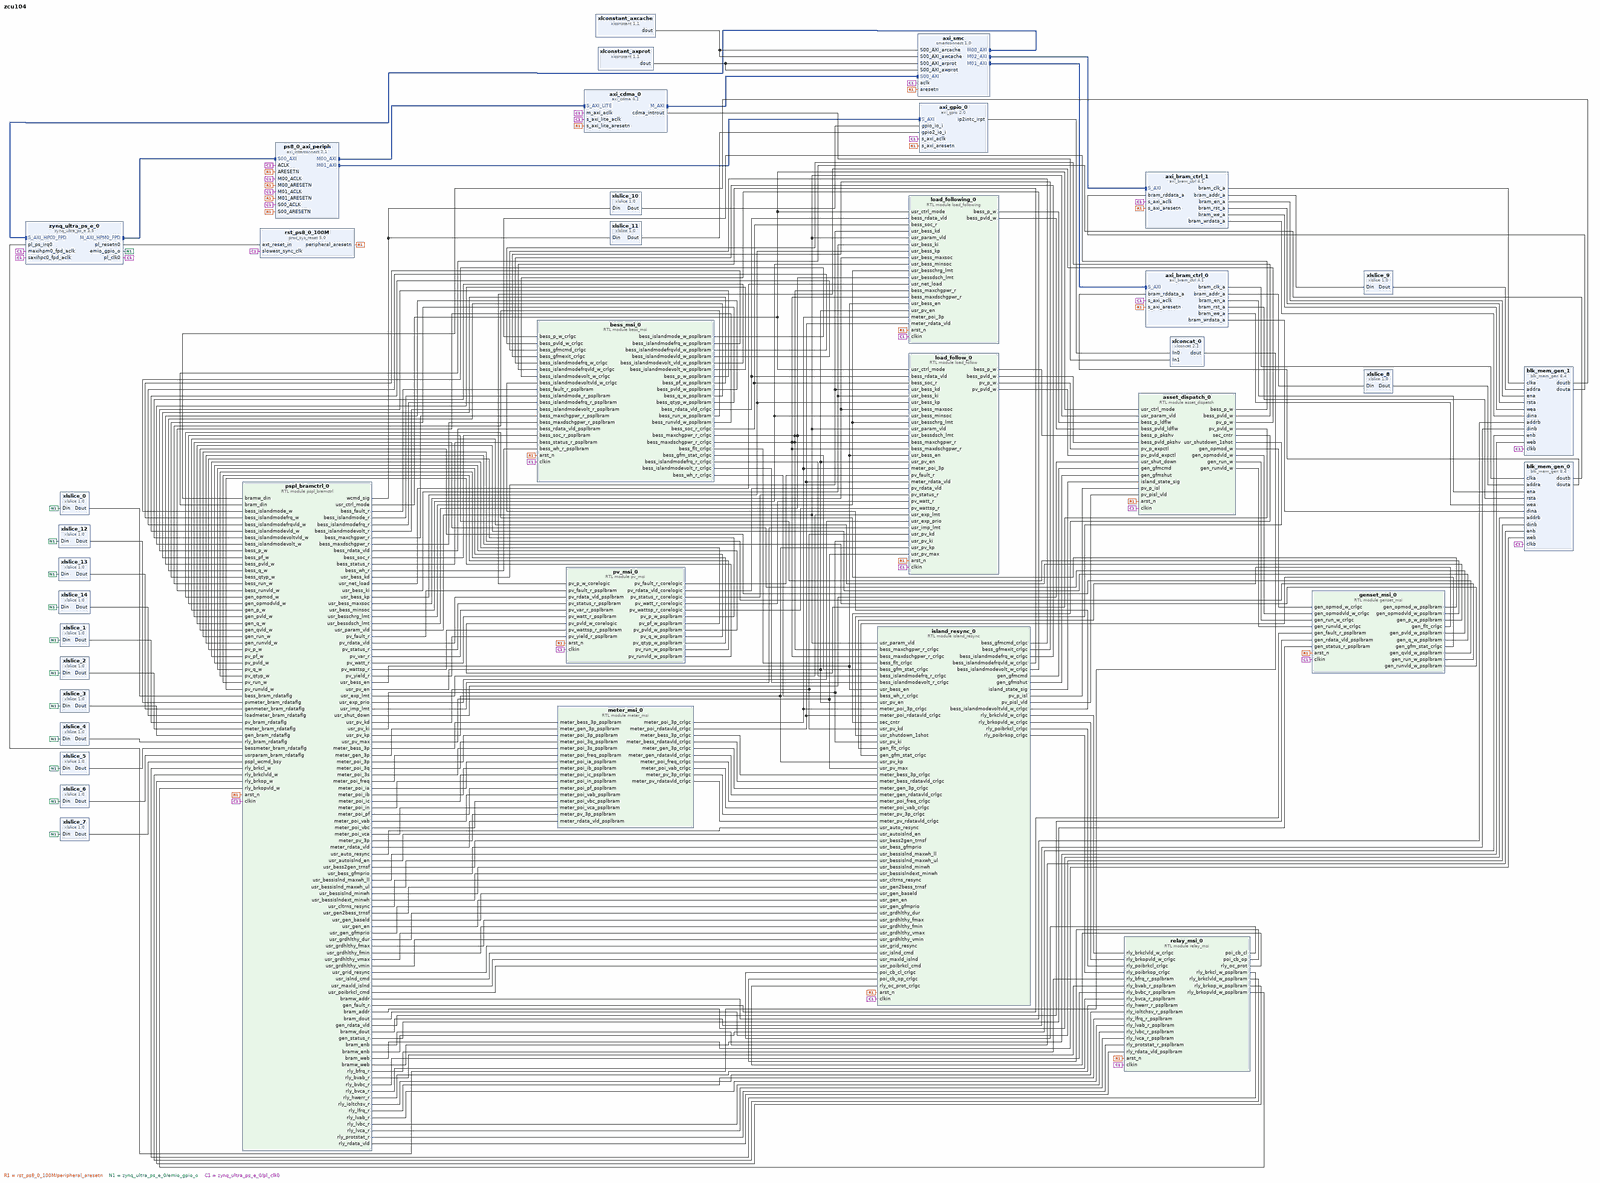
[diagram p0: block diagram of the top level, whole]
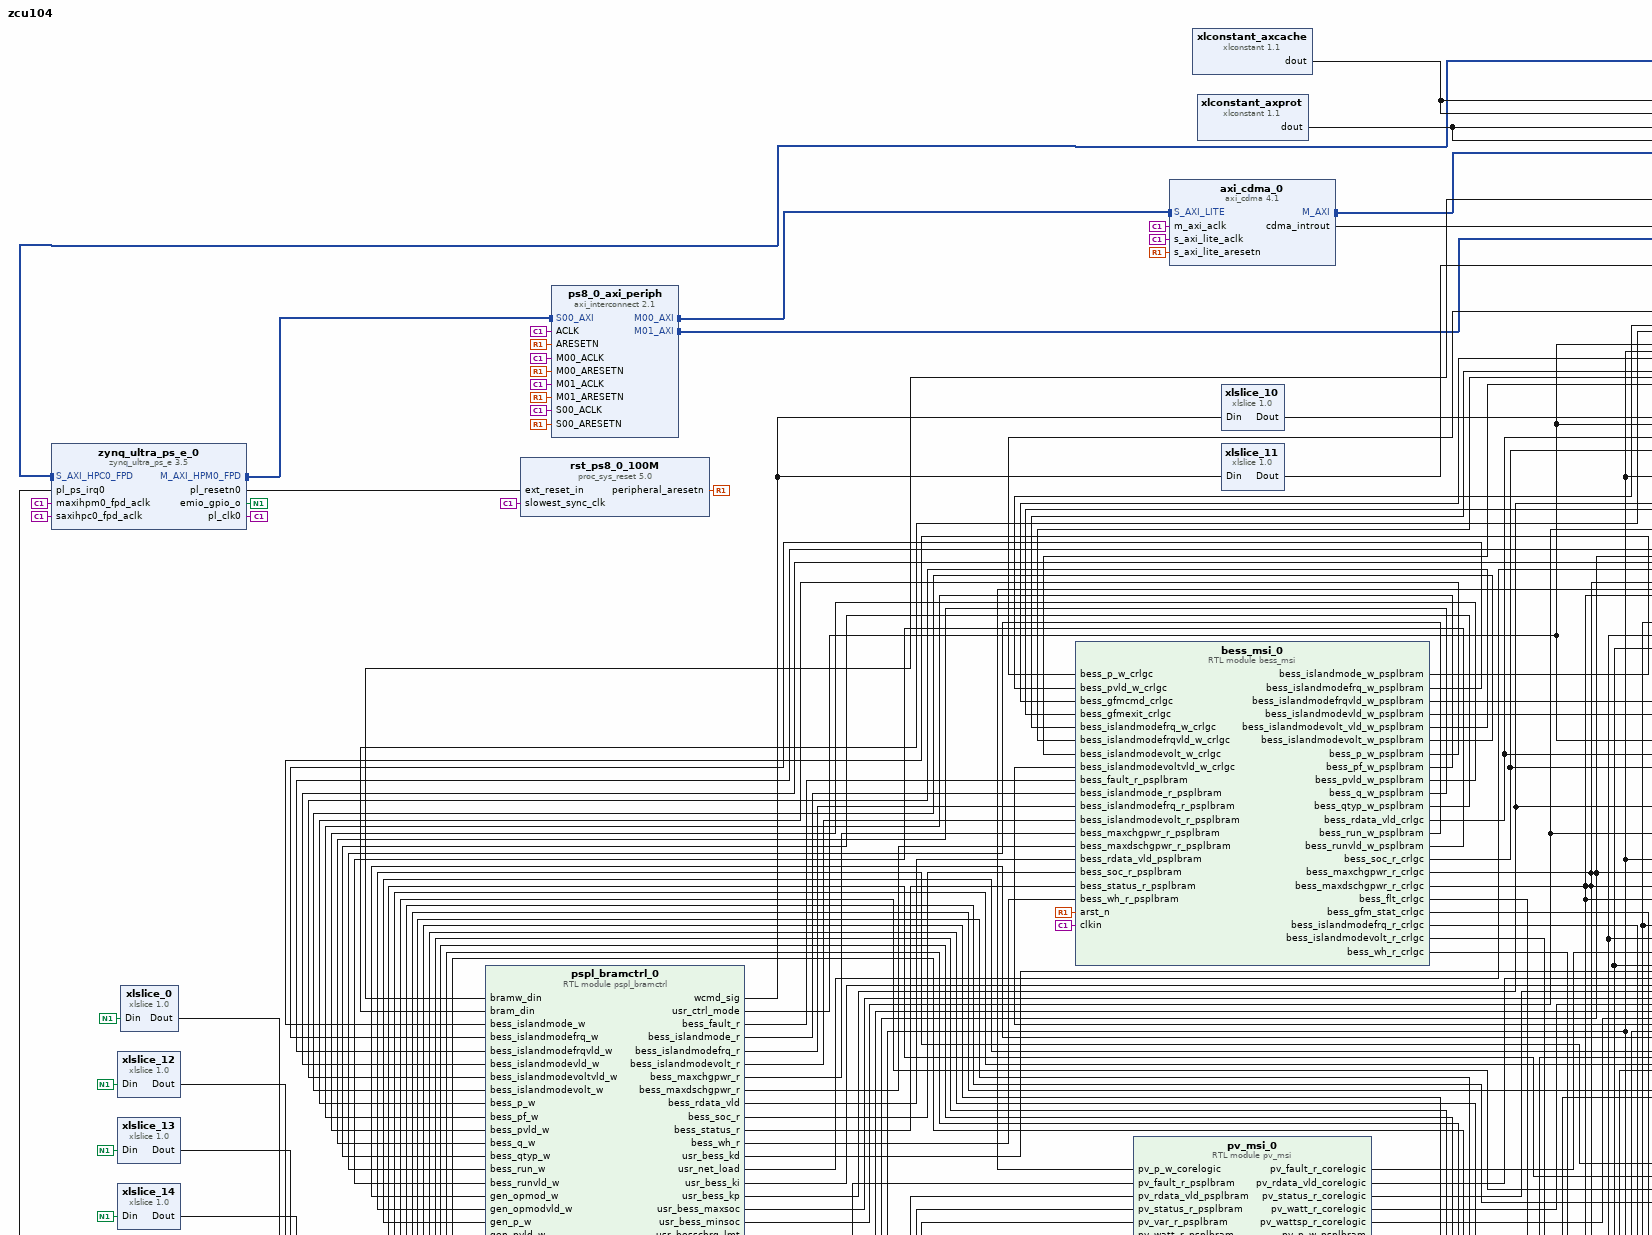
[diagram p1: block diagram of the top level, upper left part]
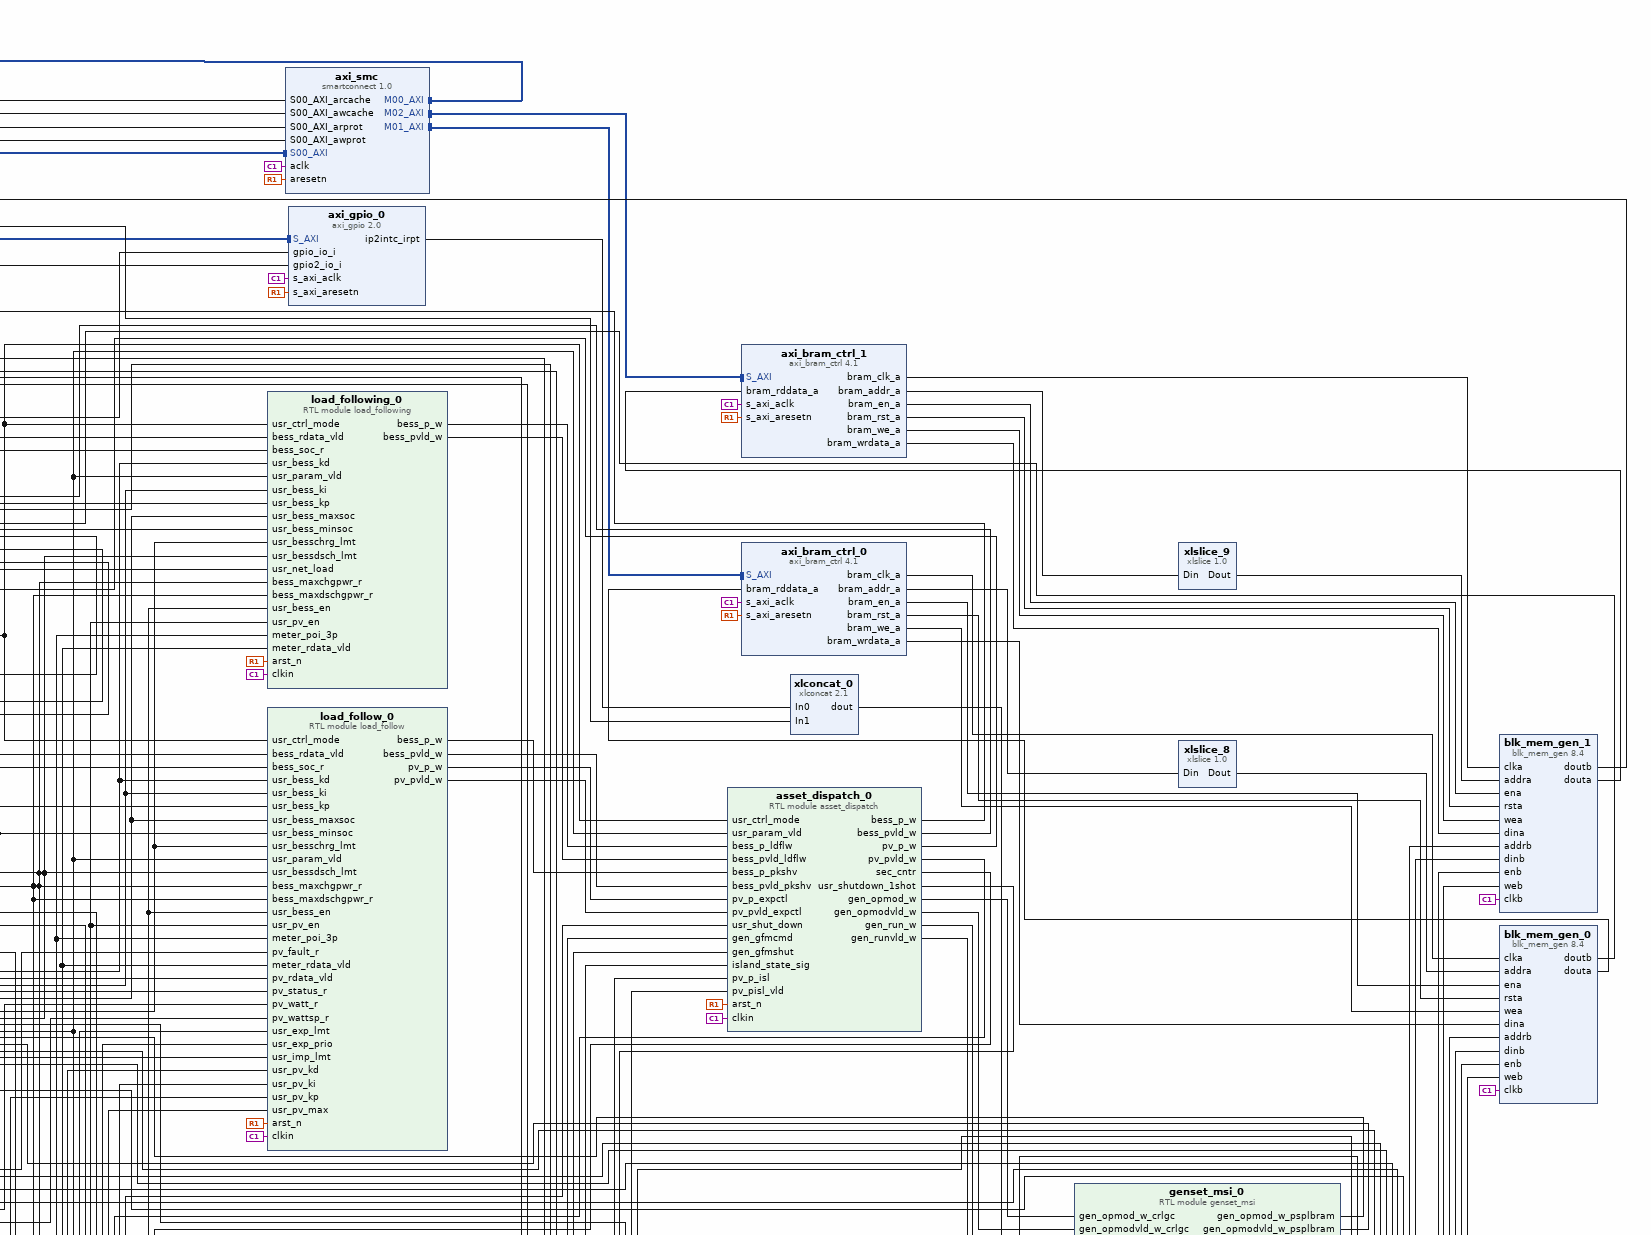
[diagram p2: block diagram of the top level, upper right part]
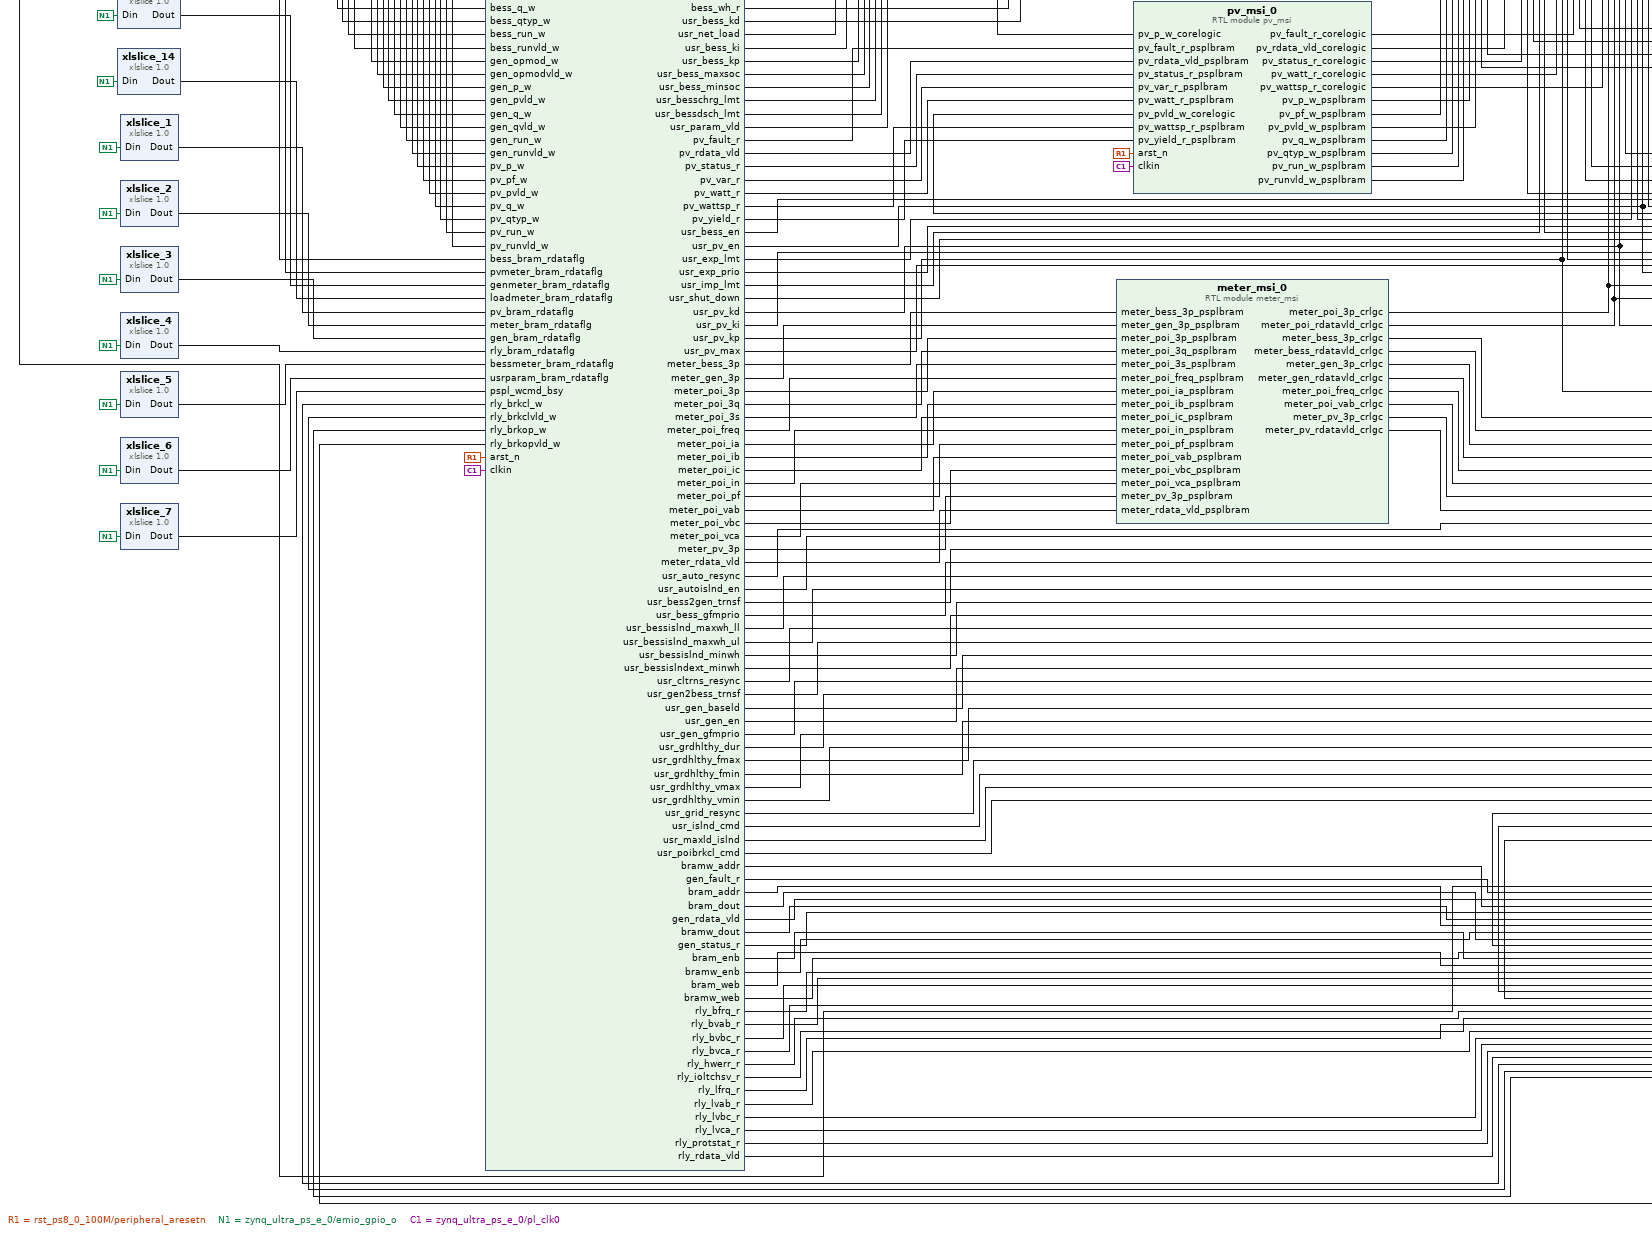
[diagram p3: block diagram of the top level, lower left part]
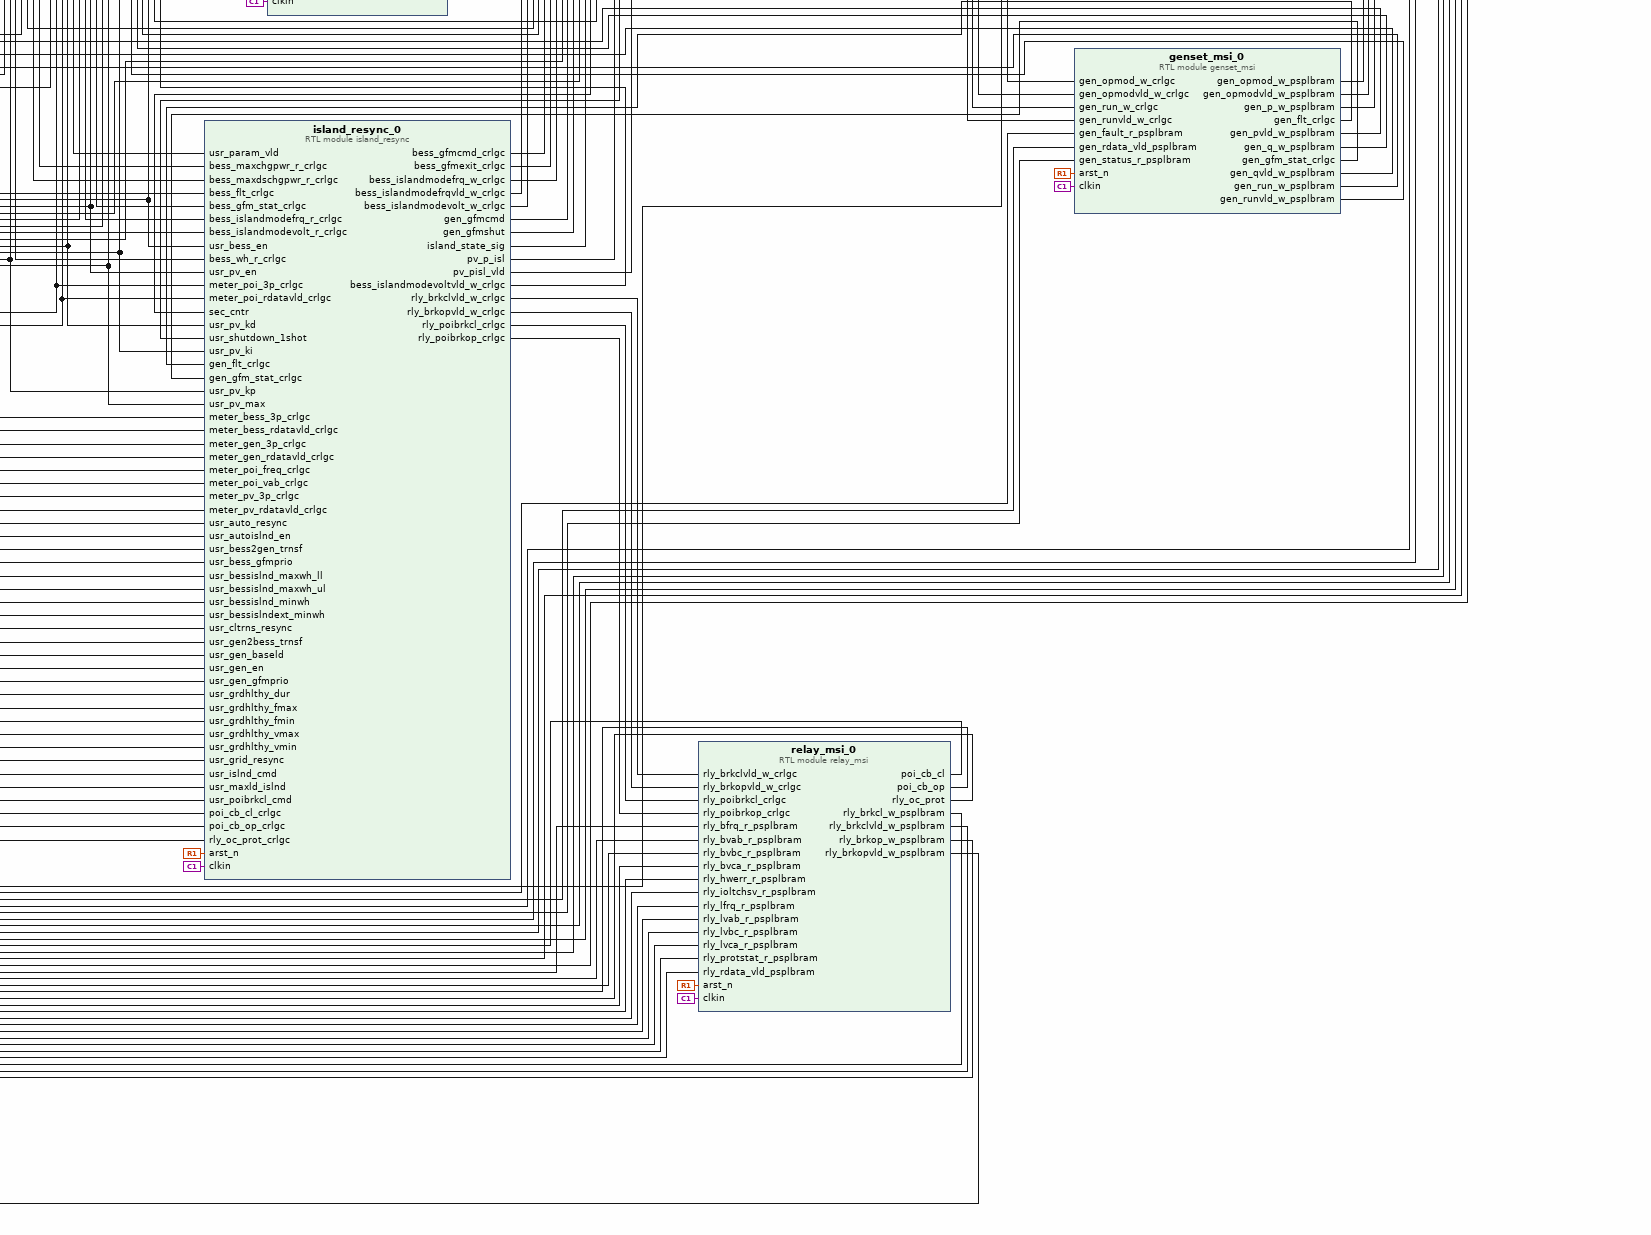
[diagram p4: block diagram of the top level, lower right part]
# Vivado block design zcu104, xczu7ev-ffvc1156-2-e, Vivado 2023.1
create_bd_design zcu104

create_bd_cell -type ip -vlnv xilinx.com:ip:xlslice:1.0 xlslice_0
set_property -dict {CONFIG.DIN_FROM 0 CONFIG.DIN_TO 0 CONFIG.DIN_WIDTH 16 CONFIG.DOUT_WIDTH 1} [get_bd_cells xlslice_0]
create_bd_cell -type ip -vlnv xilinx.com:ip:xlslice:1.0 xlslice_1
set_property -dict {CONFIG.DIN_FROM 1 CONFIG.DIN_TO 1 CONFIG.DIN_WIDTH 16 CONFIG.DOUT_WIDTH 1} [get_bd_cells xlslice_1]
create_bd_cell -type ip -vlnv xilinx.com:ip:xlslice:1.0 xlslice_2
set_property -dict {CONFIG.DIN_FROM 2 CONFIG.DIN_TO 2 CONFIG.DIN_WIDTH 16 CONFIG.DOUT_WIDTH 1} [get_bd_cells xlslice_2]
create_bd_cell -type ip -vlnv xilinx.com:ip:xlslice:1.0 xlslice_3
set_property -dict {CONFIG.DIN_FROM 3 CONFIG.DIN_TO 3 CONFIG.DIN_WIDTH 16 CONFIG.DOUT_WIDTH 1} [get_bd_cells xlslice_3]
create_bd_cell -type ip -vlnv xilinx.com:ip:xlslice:1.0 xlslice_4
set_property -dict {CONFIG.DIN_FROM 4 CONFIG.DIN_TO 4 CONFIG.DIN_WIDTH 16 CONFIG.DOUT_WIDTH 1} [get_bd_cells xlslice_4]
create_bd_cell -type ip -vlnv xilinx.com:ip:xlslice:1.0 xlslice_5
set_property -dict {CONFIG.DIN_FROM 5 CONFIG.DIN_TO 5 CONFIG.DIN_WIDTH 16 CONFIG.DOUT_WIDTH 1} [get_bd_cells xlslice_5]
create_bd_cell -type ip -vlnv xilinx.com:ip:xlslice:1.0 xlslice_6
set_property -dict {CONFIG.DIN_FROM 6 CONFIG.DIN_TO 6 CONFIG.DIN_WIDTH 16 CONFIG.DOUT_WIDTH 1} [get_bd_cells xlslice_6]
create_bd_cell -type ip -vlnv xilinx.com:ip:xlslice:1.0 xlslice_7
set_property -dict {CONFIG.DIN_FROM 7 CONFIG.DIN_TO 7 CONFIG.DIN_WIDTH 16 CONFIG.DOUT_WIDTH 1} [get_bd_cells xlslice_7]
create_bd_cell -type ip -vlnv xilinx.com:ip:xlslice:1.0 xlslice_8
set_property -dict {CONFIG.DIN_FROM 11 CONFIG.DIN_TO 2 CONFIG.DIN_WIDTH 12 CONFIG.DOUT_WIDTH 10} [get_bd_cells xlslice_8]
create_bd_cell -type ip -vlnv xilinx.com:ip:xlslice:1.0 xlslice_9
set_property -dict {CONFIG.DIN_FROM 11 CONFIG.DIN_TO 2 CONFIG.DIN_WIDTH 12 CONFIG.DOUT_WIDTH 10} [get_bd_cells xlslice_9]
create_bd_cell -type ip -vlnv xilinx.com:ip:xlslice:1.0 xlslice_10
set_property -dict {CONFIG.DIN_FROM 31 CONFIG.DIN_TO 0 CONFIG.DIN_WIDTH 64 CONFIG.DOUT_WIDTH 32} [get_bd_cells xlslice_10]
create_bd_cell -type ip -vlnv xilinx.com:ip:xlslice:1.0 xlslice_11
set_property -dict {CONFIG.DIN_FROM 63 CONFIG.DIN_TO 32 CONFIG.DIN_WIDTH 64 CONFIG.DOUT_WIDTH 32} [get_bd_cells xlslice_11]
create_bd_cell -type ip -vlnv xilinx.com:ip:xlslice:1.0 xlslice_12
set_property -dict {CONFIG.DIN_FROM 8 CONFIG.DIN_TO 8 CONFIG.DIN_WIDTH 16 CONFIG.DOUT_WIDTH 1} [get_bd_cells xlslice_12]
create_bd_cell -type ip -vlnv xilinx.com:ip:xlslice:1.0 xlslice_13
set_property -dict {CONFIG.DIN_FROM 9 CONFIG.DIN_TO 9 CONFIG.DIN_WIDTH 16 CONFIG.DOUT_WIDTH 1} [get_bd_cells xlslice_13]
create_bd_cell -type ip -vlnv xilinx.com:ip:xlslice:1.0 xlslice_14
set_property -dict {CONFIG.DIN_FROM 10 CONFIG.DIN_TO 10 CONFIG.DIN_WIDTH 16 CONFIG.DOUT_WIDTH 1} [get_bd_cells xlslice_14]
create_bd_cell -type module -reference asset_dispatch asset_dispatch_0
create_bd_cell -type module -reference bess_msi bess_msi_0
create_bd_cell -type module -reference meter_msi meter_msi_0
create_bd_cell -type module -reference relay_msi relay_msi_0
create_bd_cell -type module -reference genset_msi genset_msi_0
create_bd_cell -type ip -vlnv xilinx.com:ip:xlconcat:2.1 xlconcat_0
create_bd_cell -type ip -vlnv xilinx.com:ip:axi_bram_ctrl:4.1 axi_bram_ctrl_0
set_property -dict {CONFIG.SINGLE_PORT_BRAM 1} [get_bd_cells axi_bram_ctrl_0]
create_bd_cell -type ip -vlnv xilinx.com:ip:axi_bram_ctrl:4.1 axi_bram_ctrl_1
set_property -dict {CONFIG.SINGLE_PORT_BRAM 1} [get_bd_cells axi_bram_ctrl_1]
create_bd_cell -type ip -vlnv xilinx.com:ip:axi_cdma:4.1 axi_cdma_0
set_property -dict {CONFIG.C_ADDR_WIDTH 64 CONFIG.C_INCLUDE_DRE 1 CONFIG.C_INCLUDE_SG 0} [get_bd_cells axi_cdma_0]
create_bd_cell -type ip -vlnv xilinx.com:ip:blk_mem_gen:8.4 blk_mem_gen_1
set_property -dict [list \
  CONFIG.Byte_Size 8 \
  CONFIG.EN_SAFETY_CKT true \
  CONFIG.Enable_32bit_Address false \
  CONFIG.Enable_B Use_ENB_Pin \
  CONFIG.Memory_Type True_Dual_Port_RAM \
  CONFIG.Port_B_Clock 100 \
  CONFIG.Port_B_Enable_Rate 100 \
  CONFIG.Port_B_Write_Rate 50 \
  CONFIG.Read_Width_A 32 \
  CONFIG.Read_Width_B 32 \
  CONFIG.Register_PortA_Output_of_Memory_Primitives false \
  CONFIG.Register_PortB_Output_of_Memory_Primitives false \
  CONFIG.Use_Byte_Write_Enable true \
  CONFIG.Use_RSTA_Pin true \
  CONFIG.Use_RSTB_Pin true \
  CONFIG.Write_Depth_A 1024 \
  CONFIG.Write_Width_A 32 \
  CONFIG.Write_Width_B 32 \
  CONFIG.use_bram_block Stand_Alone \
] [get_bd_cells blk_mem_gen_1]
create_bd_cell -type ip -vlnv xilinx.com:ip:blk_mem_gen:8.4 blk_mem_gen_0
set_property -dict [list \
  CONFIG.Byte_Size 8 \
  CONFIG.EN_SAFETY_CKT true \
  CONFIG.Enable_32bit_Address false \
  CONFIG.Enable_B Use_ENB_Pin \
  CONFIG.Memory_Type True_Dual_Port_RAM \
  CONFIG.Operating_Mode_A WRITE_FIRST \
  CONFIG.Port_B_Clock 100 \
  CONFIG.Port_B_Enable_Rate 100 \
  CONFIG.Port_B_Write_Rate 50 \
  CONFIG.Read_Width_A 32 \
  CONFIG.Read_Width_B 32 \
  CONFIG.Register_PortA_Output_of_Memory_Primitives false \
  CONFIG.Register_PortB_Output_of_Memory_Primitives false \
  CONFIG.Use_Byte_Write_Enable true \
  CONFIG.Use_RSTA_Pin true \
  CONFIG.Use_RSTB_Pin true \
  CONFIG.Write_Depth_A 1024 \
  CONFIG.Write_Width_A 32 \
  CONFIG.Write_Width_B 32 \
  CONFIG.use_bram_block Stand_Alone \
] [get_bd_cells blk_mem_gen_0]
create_bd_cell -type ip -vlnv xilinx.com:ip:axi_interconnect:2.1 ps8_0_axi_periph
set_property -dict {CONFIG.NUM_MI 2} [get_bd_cells ps8_0_axi_periph]
create_bd_cell -type ip -vlnv xilinx.com:ip:xlconstant:1.1 xlconstant_axcache
set_property -dict {CONFIG.CONST_VAL 11 CONFIG.CONST_WIDTH 4} [get_bd_cells xlconstant_axcache]
create_bd_cell -type ip -vlnv xilinx.com:ip:xlconstant:1.1 xlconstant_axprot
set_property -dict {CONFIG.CONST_VAL 2 CONFIG.CONST_WIDTH 3} [get_bd_cells xlconstant_axprot]
create_bd_cell -type ip -vlnv xilinx.com:ip:axi_gpio:2.0 axi_gpio_0
set_property -dict [list \
  CONFIG.C_ALL_INPUTS 1 \
  CONFIG.C_ALL_INPUTS_2 1 \
  CONFIG.C_GPIO_WIDTH 32 \
  CONFIG.C_INTERRUPT_PRESENT 1 \
  CONFIG.C_IS_DUAL 1 \
  CONFIG.GPIO_BOARD_INTERFACE Custom \
  CONFIG.USE_BOARD_FLOW true \
] [get_bd_cells axi_gpio_0]
create_bd_cell -type ip -vlnv xilinx.com:ip:smartconnect:1.0 axi_smc
set_property -dict {CONFIG.NUM_MI 3 CONFIG.NUM_SI 1} [get_bd_cells axi_smc]
create_bd_cell -type ip -vlnv xilinx.com:ip:proc_sys_reset:5.0 rst_ps8_0_100M
create_bd_cell -type ip -vlnv xilinx.com:ip:zynq_ultra_ps_e:3.5 zynq_ultra_ps_e_0
set_property -dict [list \
  CONFIG.CAN0_BOARD_INTERFACE custom \
  CONFIG.CAN1_BOARD_INTERFACE custom \
  CONFIG.CSU_BOARD_INTERFACE custom \
  CONFIG.DP_BOARD_INTERFACE custom \
  CONFIG.GEM0_BOARD_INTERFACE custom \
  CONFIG.GEM1_BOARD_INTERFACE custom \
  CONFIG.GEM2_BOARD_INTERFACE custom \
  CONFIG.GEM3_BOARD_INTERFACE custom \
  CONFIG.GPIO_BOARD_INTERFACE custom \
  CONFIG.IIC0_BOARD_INTERFACE custom \
  CONFIG.IIC1_BOARD_INTERFACE custom \
  CONFIG.NAND_BOARD_INTERFACE custom \
  CONFIG.PCIE_BOARD_INTERFACE custom \
  CONFIG.PJTAG_BOARD_INTERFACE custom \
  CONFIG.PMU_BOARD_INTERFACE custom \
  CONFIG.PSU_BANK_0_IO_STANDARD LVCMOS18 \
  CONFIG.PSU_BANK_1_IO_STANDARD LVCMOS18 \
  CONFIG.PSU_BANK_2_IO_STANDARD LVCMOS18 \
  CONFIG.PSU_BANK_3_IO_STANDARD LVCMOS33 \
  CONFIG.PSU_USB3__DUAL_CLOCK_ENABLE 1 \
  CONFIG.PSU__AFI0_COHERENCY 1 \
  CONFIG.PSU__CAN1__PERIPHERAL__ENABLE 1 \
  CONFIG.PSU__CAN1__PERIPHERAL__IO {MIO 24 .. 25} \
  CONFIG.PSU__CRF_APB__ACPU_CTRL__FREQMHZ 1200 \
  CONFIG.PSU__CRF_APB__ACPU_CTRL__SRCSEL APLL \
  CONFIG.PSU__CRF_APB__APLL_CTRL__SRCSEL PSS_REF_CLK \
  CONFIG.PSU__CRF_APB__DBG_FPD_CTRL__FREQMHZ 250 \
  CONFIG.PSU__CRF_APB__DBG_FPD_CTRL__SRCSEL IOPLL \
  CONFIG.PSU__CRF_APB__DBG_TRACE_CTRL__FREQMHZ 250 \
  CONFIG.PSU__CRF_APB__DBG_TRACE_CTRL__SRCSEL IOPLL \
  CONFIG.PSU__CRF_APB__DBG_TSTMP_CTRL__FREQMHZ 250 \
  CONFIG.PSU__CRF_APB__DBG_TSTMP_CTRL__SRCSEL IOPLL \
  CONFIG.PSU__CRF_APB__DDR_CTRL__FREQMHZ 1067 \
  CONFIG.PSU__CRF_APB__DDR_CTRL__SRCSEL DPLL \
  CONFIG.PSU__CRF_APB__DPDMA_REF_CTRL__FREQMHZ 600 \
  CONFIG.PSU__CRF_APB__DPDMA_REF_CTRL__SRCSEL APLL \
  CONFIG.PSU__CRF_APB__DPLL_CTRL__SRCSEL PSS_REF_CLK \
  CONFIG.PSU__CRF_APB__DP_AUDIO_REF_CTRL__SRCSEL RPLL \
  CONFIG.PSU__CRF_APB__DP_STC_REF_CTRL__SRCSEL RPLL \
  CONFIG.PSU__CRF_APB__DP_VIDEO_REF_CTRL__SRCSEL VPLL \
  CONFIG.PSU__CRF_APB__GDMA_REF_CTRL__FREQMHZ 600 \
  CONFIG.PSU__CRF_APB__GDMA_REF_CTRL__SRCSEL APLL \
  CONFIG.PSU__CRF_APB__GPU_REF_CTRL__FREQMHZ 500 \
  CONFIG.PSU__CRF_APB__GPU_REF_CTRL__SRCSEL IOPLL \
  CONFIG.PSU__CRF_APB__TOPSW_LSBUS_CTRL__FREQMHZ 100 \
  CONFIG.PSU__CRF_APB__TOPSW_LSBUS_CTRL__SRCSEL IOPLL \
  CONFIG.PSU__CRF_APB__TOPSW_MAIN_CTRL__FREQMHZ 533.33 \
  CONFIG.PSU__CRF_APB__TOPSW_MAIN_CTRL__SRCSEL DPLL \
  CONFIG.PSU__CRF_APB__VPLL_CTRL__SRCSEL PSS_REF_CLK \
  CONFIG.PSU__CRL_APB__ADMA_REF_CTRL__FREQMHZ 500 \
  CONFIG.PSU__CRL_APB__ADMA_REF_CTRL__SRCSEL IOPLL \
  CONFIG.PSU__CRL_APB__CAN1_REF_CTRL__FREQMHZ 100 \
  CONFIG.PSU__CRL_APB__CAN1_REF_CTRL__SRCSEL IOPLL \
  CONFIG.PSU__CRL_APB__CPU_R5_CTRL__FREQMHZ 500 \
  CONFIG.PSU__CRL_APB__CPU_R5_CTRL__SRCSEL IOPLL \
  CONFIG.PSU__CRL_APB__DBG_LPD_CTRL__FREQMHZ 250 \
  CONFIG.PSU__CRL_APB__DBG_LPD_CTRL__SRCSEL IOPLL \
  CONFIG.PSU__CRL_APB__GEM3_REF_CTRL__FREQMHZ 125 \
  CONFIG.PSU__CRL_APB__GEM3_REF_CTRL__SRCSEL IOPLL \
  CONFIG.PSU__CRL_APB__I2C0_REF_CTRL__FREQMHZ 100 \
  CONFIG.PSU__CRL_APB__I2C0_REF_CTRL__SRCSEL IOPLL \
  CONFIG.PSU__CRL_APB__I2C1_REF_CTRL__FREQMHZ 100 \
  CONFIG.PSU__CRL_APB__I2C1_REF_CTRL__SRCSEL IOPLL \
  CONFIG.PSU__CRL_APB__IOPLL_CTRL__SRCSEL PSS_REF_CLK \
  CONFIG.PSU__CRL_APB__IOU_SWITCH_CTRL__FREQMHZ 250 \
  CONFIG.PSU__CRL_APB__IOU_SWITCH_CTRL__SRCSEL IOPLL \
  CONFIG.PSU__CRL_APB__LPD_LSBUS_CTRL__FREQMHZ 100 \
  CONFIG.PSU__CRL_APB__LPD_LSBUS_CTRL__SRCSEL IOPLL \
  CONFIG.PSU__CRL_APB__LPD_SWITCH_CTRL__FREQMHZ 500 \
  CONFIG.PSU__CRL_APB__LPD_SWITCH_CTRL__SRCSEL IOPLL \
  CONFIG.PSU__CRL_APB__PCAP_CTRL__FREQMHZ 200 \
  CONFIG.PSU__CRL_APB__PCAP_CTRL__SRCSEL IOPLL \
  CONFIG.PSU__CRL_APB__PL0_REF_CTRL__FREQMHZ 300 \
  CONFIG.PSU__CRL_APB__PL0_REF_CTRL__SRCSEL IOPLL \
  CONFIG.PSU__CRL_APB__QSPI_REF_CTRL__FREQMHZ 125 \
  CONFIG.PSU__CRL_APB__QSPI_REF_CTRL__SRCSEL IOPLL \
  CONFIG.PSU__CRL_APB__RPLL_CTRL__SRCSEL PSS_REF_CLK \
  CONFIG.PSU__CRL_APB__SDIO1_REF_CTRL__FREQMHZ 200 \
  CONFIG.PSU__CRL_APB__SDIO1_REF_CTRL__SRCSEL IOPLL \
  CONFIG.PSU__CRL_APB__TIMESTAMP_REF_CTRL__FREQMHZ 100 \
  CONFIG.PSU__CRL_APB__TIMESTAMP_REF_CTRL__SRCSEL IOPLL \
  CONFIG.PSU__CRL_APB__UART0_REF_CTRL__FREQMHZ 100 \
  CONFIG.PSU__CRL_APB__UART0_REF_CTRL__SRCSEL IOPLL \
  CONFIG.PSU__CRL_APB__UART1_REF_CTRL__FREQMHZ 100 \
  CONFIG.PSU__CRL_APB__UART1_REF_CTRL__SRCSEL IOPLL \
  CONFIG.PSU__CRL_APB__USB0_BUS_REF_CTRL__FREQMHZ 250 \
  CONFIG.PSU__CRL_APB__USB0_BUS_REF_CTRL__SRCSEL IOPLL \
  CONFIG.PSU__CRL_APB__USB3_DUAL_REF_CTRL__FREQMHZ 20 \
  CONFIG.PSU__CRL_APB__USB3_DUAL_REF_CTRL__SRCSEL IOPLL \
  CONFIG.PSU__CRL_APB__USB3__ENABLE 1 \
  CONFIG.PSU__CSUPMU__PERIPHERAL__VALID 1 \
  CONFIG.PSU__DDRC__BUS_WIDTH {64 Bit} \
  CONFIG.PSU__DDRC__COMPONENTS UDIMM \
  CONFIG.PSU__DDRC__DEVICE_CAPACITY {8192 MBits} \
  CONFIG.PSU__DDRC__DRAM_WIDTH {16 Bits} \
  CONFIG.PSU__DDRC__ECC Disabled \
  CONFIG.PSU__DDRC__MEMORY_TYPE {DDR 4} \
  CONFIG.PSU__DDRC__SPEED_BIN DDR4_2133P \
  CONFIG.PSU__DDR_HIGH_ADDRESS_GUI_ENABLE 1 \
  CONFIG.PSU__DDR__INTERFACE__FREQMHZ 533.500 \
  CONFIG.PSU__DEVICE_TYPE EV \
  CONFIG.PSU__DISPLAYPORT__LANE0__ENABLE 1 \
  CONFIG.PSU__DISPLAYPORT__LANE0__IO {GT Lane1} \
  CONFIG.PSU__DISPLAYPORT__LANE1__ENABLE 1 \
  CONFIG.PSU__DISPLAYPORT__LANE1__IO {GT Lane0} \
  CONFIG.PSU__DISPLAYPORT__PERIPHERAL__ENABLE 1 \
  CONFIG.PSU__DLL__ISUSED 1 \
  CONFIG.PSU__DPAUX__PERIPHERAL__ENABLE 1 \
  CONFIG.PSU__DPAUX__PERIPHERAL__IO {MIO 27 .. 30} \
  CONFIG.PSU__DP__LANE_SEL {Dual Lower} \
  CONFIG.PSU__DP__REF_CLK_FREQ 27 \
  CONFIG.PSU__DP__REF_CLK_SEL {Ref Clk3} \
  CONFIG.PSU__ENET3__FIFO__ENABLE 0 \
  CONFIG.PSU__ENET3__GRP_MDIO__ENABLE 1 \
  CONFIG.PSU__ENET3__GRP_MDIO__IO {MIO 76 .. 77} \
  CONFIG.PSU__ENET3__PERIPHERAL__ENABLE 1 \
  CONFIG.PSU__ENET3__PERIPHERAL__IO {MIO 64 .. 75} \
  CONFIG.PSU__ENET3__PTP__ENABLE 0 \
  CONFIG.PSU__ENET3__TSU__ENABLE 0 \
  CONFIG.PSU__FPGA_PL0_ENABLE 1 \
  CONFIG.PSU__GEM3_COHERENCY 0 \
  CONFIG.PSU__GEM3_ROUTE_THROUGH_FPD 0 \
  CONFIG.PSU__GEM__TSU__ENABLE 0 \
  CONFIG.PSU__GPIO0_MIO__IO {MIO 0 .. 25} \
  CONFIG.PSU__GPIO0_MIO__PERIPHERAL__ENABLE 1 \
  CONFIG.PSU__GPIO1_MIO__IO {MIO 26 .. 51} \
  CONFIG.PSU__GPIO1_MIO__PERIPHERAL__ENABLE 1 \
  CONFIG.PSU__GPIO_EMIO_WIDTH 16 \
  CONFIG.PSU__GPIO_EMIO__PERIPHERAL__ENABLE 1 \
  CONFIG.PSU__GPIO_EMIO__PERIPHERAL__IO 16 \
  CONFIG.PSU__GT__LINK_SPEED HBR \
  CONFIG.PSU__GT__PRE_EMPH_LVL_4 0 \
  CONFIG.PSU__GT__VLT_SWNG_LVL_4 0 \
  CONFIG.PSU__I2C0__PERIPHERAL__ENABLE 1 \
  CONFIG.PSU__I2C0__PERIPHERAL__IO {MIO 14 .. 15} \
  CONFIG.PSU__I2C1__PERIPHERAL__ENABLE 1 \
  CONFIG.PSU__I2C1__PERIPHERAL__IO {MIO 16 .. 17} \
  CONFIG.PSU__IOU_SLCR__IOU_TTC_APB_CLK__TTC0_SEL APB \
  CONFIG.PSU__IOU_SLCR__IOU_TTC_APB_CLK__TTC1_SEL APB \
  CONFIG.PSU__IOU_SLCR__IOU_TTC_APB_CLK__TTC2_SEL APB \
  CONFIG.PSU__IOU_SLCR__IOU_TTC_APB_CLK__TTC3_SEL APB \
  CONFIG.PSU__MAXIGP0__DATA_WIDTH 32 \
  CONFIG.PSU__OVERRIDE_HPX_QOS 0 \
  CONFIG.PSU__OVERRIDE__BASIC_CLOCK 0 \
  CONFIG.PSU__PMU_COHERENCY 0 \
  CONFIG.PSU__PMU__AIBACK__ENABLE 0 \
  CONFIG.PSU__PMU__EMIO_GPI__ENABLE 0 \
  CONFIG.PSU__PMU__EMIO_GPO__ENABLE 0 \
  CONFIG.PSU__PMU__GPI0__ENABLE 0 \
  CONFIG.PSU__PMU__GPI1__ENABLE 0 \
  CONFIG.PSU__PMU__GPI2__ENABLE 0 \
  CONFIG.PSU__PMU__GPI3__ENABLE 0 \
  CONFIG.PSU__PMU__GPI4__ENABLE 0 \
  CONFIG.PSU__PMU__GPI5__ENABLE 0 \
  CONFIG.PSU__PMU__GPO0__ENABLE 0 \
  CONFIG.PSU__PMU__GPO1__ENABLE 0 \
  CONFIG.PSU__PMU__GPO2__ENABLE 0 \
  CONFIG.PSU__PMU__GPO3__ENABLE 0 \
  CONFIG.PSU__PMU__GPO4__ENABLE 0 \
  CONFIG.PSU__PMU__GPO5__ENABLE 0 \
  CONFIG.PSU__PMU__PERIPHERAL__ENABLE 1 \
  CONFIG.PSU__PMU__PLERROR__ENABLE 0 \
  CONFIG.PSU__PRESET_APPLIED 1 \
  CONFIG.PSU__PSS_REF_CLK__FREQMHZ 33.333333 \
  CONFIG.PSU__QSPI_COHERENCY 0 \
  CONFIG.PSU__QSPI_ROUTE_THROUGH_FPD 0 \
  CONFIG.PSU__QSPI__GRP_FBCLK__ENABLE 1 \
  CONFIG.PSU__QSPI__GRP_FBCLK__IO {MIO 6} \
  CONFIG.PSU__QSPI__PERIPHERAL__DATA_MODE x4 \
  CONFIG.PSU__QSPI__PERIPHERAL__ENABLE 1 \
  CONFIG.PSU__QSPI__PERIPHERAL__IO {MIO 0 .. 12} \
  CONFIG.PSU__QSPI__PERIPHERAL__MODE {Dual Parallel} \
  CONFIG.PSU__SATA__LANE1__IO {GT Lane3} \
  CONFIG.PSU__SATA__PERIPHERAL__ENABLE 1 \
  CONFIG.PSU__SATA__REF_CLK_FREQ 125 \
  CONFIG.PSU__SATA__REF_CLK_SEL {Ref Clk1} \
  CONFIG.PSU__SD0__CLK_100_SDR_OTAP_DLY 0x3 \
  CONFIG.PSU__SD0__CLK_200_SDR_OTAP_DLY 0x3 \
  CONFIG.PSU__SD0__CLK_50_DDR_ITAP_DLY 0x3D \
  CONFIG.PSU__SD0__CLK_50_DDR_OTAP_DLY 0x4 \
  CONFIG.PSU__SD0__CLK_50_SDR_ITAP_DLY 0x15 \
  CONFIG.PSU__SD0__CLK_50_SDR_OTAP_DLY 0x5 \
  CONFIG.PSU__SD1_COHERENCY 0 \
  CONFIG.PSU__SD1_ROUTE_THROUGH_FPD 0 \
  CONFIG.PSU__SD1__CLK_100_SDR_OTAP_DLY 0x3 \
  CONFIG.PSU__SD1__CLK_200_SDR_OTAP_DLY 0x3 \
  CONFIG.PSU__SD1__CLK_50_DDR_ITAP_DLY 0x3D \
  CONFIG.PSU__SD1__CLK_50_DDR_OTAP_DLY 0x4 \
  CONFIG.PSU__SD1__CLK_50_SDR_ITAP_DLY 0x15 \
  CONFIG.PSU__SD1__CLK_50_SDR_OTAP_DLY 0x5 \
  CONFIG.PSU__SD1__DATA_TRANSFER_MODE 8Bit \
  CONFIG.PSU__SD1__GRP_CD__ENABLE 1 \
  CONFIG.PSU__SD1__GRP_CD__IO {MIO 45} \
  CONFIG.PSU__SD1__GRP_POW__ENABLE 1 \
  CONFIG.PSU__SD1__GRP_POW__IO {MIO 43} \
  CONFIG.PSU__SD1__GRP_WP__ENABLE 1 \
  CONFIG.PSU__SD1__GRP_WP__IO {MIO 44} \
  CONFIG.PSU__SD1__PERIPHERAL__ENABLE 1 \
  CONFIG.PSU__SD1__PERIPHERAL__IO {MIO 39 .. 51} \
  CONFIG.PSU__SD1__SLOT_TYPE {SD 3.0} \
  CONFIG.PSU__SWDT0__CLOCK__ENABLE 0 \
  CONFIG.PSU__SWDT0__PERIPHERAL__ENABLE 1 \
  CONFIG.PSU__SWDT0__RESET__ENABLE 0 \
  CONFIG.PSU__SWDT1__CLOCK__ENABLE 0 \
  CONFIG.PSU__SWDT1__PERIPHERAL__ENABLE 1 \
  CONFIG.PSU__SWDT1__RESET__ENABLE 0 \
  CONFIG.PSU__TSU__BUFG_PORT_PAIR 0 \
  CONFIG.PSU__TTC0__CLOCK__ENABLE 0 \
  CONFIG.PSU__TTC0__PERIPHERAL__ENABLE 1 \
  CONFIG.PSU__TTC0__WAVEOUT__ENABLE 0 \
  CONFIG.PSU__TTC1__CLOCK__ENABLE 0 \
  CONFIG.PSU__TTC1__PERIPHERAL__ENABLE 1 \
  CONFIG.PSU__TTC1__WAVEOUT__ENABLE 0 \
  CONFIG.PSU__TTC2__CLOCK__ENABLE 0 \
  CONFIG.PSU__TTC2__PERIPHERAL__ENABLE 1 \
  CONFIG.PSU__TTC2__WAVEOUT__ENABLE 0 \
  CONFIG.PSU__TTC3__CLOCK__ENABLE 0 \
  CONFIG.PSU__TTC3__PERIPHERAL__ENABLE 1 \
  CONFIG.PSU__TTC3__WAVEOUT__ENABLE 0 \
  CONFIG.PSU__UART0__BAUD_RATE 115200 \
  CONFIG.PSU__UART0__MODEM__ENABLE 0 \
  CONFIG.PSU__UART0__PERIPHERAL__ENABLE 1 \
  CONFIG.PSU__UART0__PERIPHERAL__IO {MIO 18 .. 19} \
  CONFIG.PSU__UART1__BAUD_RATE 115200 \
  CONFIG.PSU__UART1__MODEM__ENABLE 0 \
  CONFIG.PSU__UART1__PERIPHERAL__ENABLE 1 \
  CONFIG.PSU__UART1__PERIPHERAL__IO {MIO 20 .. 21} \
  CONFIG.PSU__USB0_COHERENCY 0 \
  CONFIG.PSU__USB0__PERIPHERAL__ENABLE 1 \
  CONFIG.PSU__USB0__PERIPHERAL__IO {MIO 52 .. 63} \
  CONFIG.PSU__USB0__REF_CLK_FREQ 26 \
  CONFIG.PSU__USB0__REF_CLK_SEL {Ref Clk2} \
  CONFIG.PSU__USB2_0__EMIO__ENABLE 0 \
  CONFIG.PSU__USB3_0__EMIO__ENABLE 0 \
  CONFIG.PSU__USB3_0__PERIPHERAL__ENABLE 1 \
  CONFIG.PSU__USB3_0__PERIPHERAL__IO {GT Lane2} \
  CONFIG.PSU__USB__RESET__MODE {Boot Pin} \
  CONFIG.PSU__USB__RESET__POLARITY {Active Low} \
  CONFIG.PSU__USE__IRQ0 1 \
  CONFIG.PSU__USE__M_AXI_GP0 1 \
  CONFIG.PSU__USE__M_AXI_GP1 0 \
  CONFIG.PSU__USE__M_AXI_GP2 0 \
  CONFIG.PSU__USE__S_AXI_GP0 1 \
  CONFIG.QSPI_BOARD_INTERFACE custom \
  CONFIG.SATA_BOARD_INTERFACE custom \
  CONFIG.SD0_BOARD_INTERFACE custom \
  CONFIG.SD1_BOARD_INTERFACE custom \
  CONFIG.SPI0_BOARD_INTERFACE custom \
  CONFIG.SPI1_BOARD_INTERFACE custom \
  CONFIG.SUBPRESET1 Custom \
  CONFIG.SUBPRESET2 Custom \
  CONFIG.SWDT0_BOARD_INTERFACE custom \
  CONFIG.SWDT1_BOARD_INTERFACE custom \
  CONFIG.TRACE_BOARD_INTERFACE custom \
  CONFIG.TTC0_BOARD_INTERFACE custom \
  CONFIG.TTC1_BOARD_INTERFACE custom \
  CONFIG.TTC2_BOARD_INTERFACE custom \
  CONFIG.TTC3_BOARD_INTERFACE custom \
  CONFIG.UART0_BOARD_INTERFACE custom \
  CONFIG.UART1_BOARD_INTERFACE custom \
  CONFIG.USB0_BOARD_INTERFACE custom \
  CONFIG.USB1_BOARD_INTERFACE custom \
] [get_bd_cells zynq_ultra_ps_e_0]
# 735 more settings of zynq_ultra_ps_e_0 are not shown: defaults, MIO pin electricals, DDR timing, and values the tool derives
create_bd_cell -type module -reference load_following load_following_0
create_bd_cell -type module -reference island_resync island_resync_0
create_bd_cell -type module -reference pv_msi pv_msi_0
create_bd_cell -type module -reference pspl_bramctrl pspl_bramctrl_0
create_bd_cell -type module -reference load_follow load_follow_0

# ---- connections ----

connect_bd_intf_net [get_bd_intf_pins axi_cdma_0/M_AXI] [get_bd_intf_pins axi_smc/S00_AXI]
connect_bd_intf_net [get_bd_intf_pins axi_smc/M00_AXI] [get_bd_intf_pins zynq_ultra_ps_e_0/S_AXI_HPC0_FPD]
connect_bd_intf_net [get_bd_intf_pins axi_smc/M01_AXI] [get_bd_intf_pins axi_bram_ctrl_0/S_AXI]
connect_bd_intf_net [get_bd_intf_pins axi_bram_ctrl_1/S_AXI] [get_bd_intf_pins axi_smc/M02_AXI]
connect_bd_intf_net [get_bd_intf_pins ps8_0_axi_periph/M00_AXI] [get_bd_intf_pins axi_cdma_0/S_AXI_LITE]
connect_bd_intf_net [get_bd_intf_pins axi_gpio_0/S_AXI] [get_bd_intf_pins ps8_0_axi_periph/M01_AXI]
connect_bd_intf_net [get_bd_intf_pins zynq_ultra_ps_e_0/M_AXI_HPM0_FPD] [get_bd_intf_pins ps8_0_axi_periph/S00_AXI]
connect_bd_net [get_bd_pins xlslice_0/Dout] [get_bd_pins pspl_bramctrl_0/bess_bram_rdataflg]
connect_bd_net [get_bd_pins asset_dispatch_0/bess_p_w] [get_bd_pins bess_msi_0/bess_p_w_crlgc]
connect_bd_net [get_bd_pins asset_dispatch_0/bess_pvld_w] [get_bd_pins bess_msi_0/bess_pvld_w_crlgc]
connect_bd_net [get_bd_pins asset_dispatch_0/gen_opmod_w] [get_bd_pins genset_msi_0/gen_opmod_w_crlgc]
connect_bd_net [get_bd_pins asset_dispatch_0/gen_opmodvld_w] [get_bd_pins genset_msi_0/gen_opmodvld_w_crlgc]
connect_bd_net [get_bd_pins asset_dispatch_0/gen_run_w] [get_bd_pins genset_msi_0/gen_run_w_crlgc]
connect_bd_net [get_bd_pins asset_dispatch_0/gen_runvld_w] [get_bd_pins genset_msi_0/gen_runvld_w_crlgc]
connect_bd_net [get_bd_pins asset_dispatch_0/pv_p_w] [get_bd_pins pv_msi_0/pv_p_w_corelogic]
connect_bd_net [get_bd_pins asset_dispatch_0/pv_pvld_w] [get_bd_pins pv_msi_0/pv_pvld_w_corelogic]
connect_bd_net [get_bd_pins asset_dispatch_0/sec_cntr] [get_bd_pins island_resync_0/sec_cntr]
connect_bd_net [get_bd_pins asset_dispatch_0/usr_shutdown_1shot] [get_bd_pins island_resync_0/usr_shutdown_1shot]
connect_bd_net [get_bd_pins axi_bram_ctrl_0/bram_addr_a] [get_bd_pins xlslice_8/Din]
connect_bd_net [get_bd_pins axi_bram_ctrl_0/bram_clk_a] [get_bd_pins blk_mem_gen_0/clka]
connect_bd_net [get_bd_pins axi_bram_ctrl_0/bram_en_a] [get_bd_pins blk_mem_gen_0/ena]
connect_bd_net [get_bd_pins axi_bram_ctrl_0/bram_rst_a] [get_bd_pins blk_mem_gen_0/rsta]
connect_bd_net [get_bd_pins axi_bram_ctrl_0/bram_we_a] [get_bd_pins blk_mem_gen_0/wea]
connect_bd_net [get_bd_pins axi_bram_ctrl_0/bram_wrdata_a] [get_bd_pins blk_mem_gen_0/dina]
connect_bd_net [get_bd_pins axi_bram_ctrl_1/bram_addr_a] [get_bd_pins xlslice_9/Din]
connect_bd_net [get_bd_pins axi_bram_ctrl_1/bram_clk_a] [get_bd_pins blk_mem_gen_1/clka]
connect_bd_net [get_bd_pins axi_bram_ctrl_1/bram_en_a] [get_bd_pins blk_mem_gen_1/ena]
connect_bd_net [get_bd_pins axi_bram_ctrl_1/bram_rst_a] [get_bd_pins blk_mem_gen_1/rsta]
connect_bd_net [get_bd_pins axi_bram_ctrl_1/bram_we_a] [get_bd_pins blk_mem_gen_1/wea]
connect_bd_net [get_bd_pins axi_bram_ctrl_1/bram_wrdata_a] [get_bd_pins blk_mem_gen_1/dina]
connect_bd_net [get_bd_pins axi_cdma_0/cdma_introut] [get_bd_pins xlconcat_0/In1]
connect_bd_net [get_bd_pins axi_gpio_0/ip2intc_irpt] [get_bd_pins xlconcat_0/In0]
connect_bd_net [get_bd_pins bess_msi_0/bess_flt_crlgc] [get_bd_pins island_resync_0/bess_flt_crlgc]
connect_bd_net [get_bd_pins bess_msi_0/bess_gfm_stat_crlgc] [get_bd_pins island_resync_0/bess_gfm_stat_crlgc]
connect_bd_net [get_bd_pins bess_msi_0/bess_islandmode_w_psplbram] [get_bd_pins pspl_bramctrl_0/bess_islandmode_w]
connect_bd_net [get_bd_pins bess_msi_0/bess_islandmodefrq_r_crlgc] [get_bd_pins island_resync_0/bess_islandmodefrq_r_crlgc]
connect_bd_net [get_bd_pins bess_msi_0/bess_islandmodefrq_w_psplbram] [get_bd_pins pspl_bramctrl_0/bess_islandmodefrq_w]
connect_bd_net [get_bd_pins bess_msi_0/bess_islandmodefrqvld_w_psplbram] [get_bd_pins pspl_bramctrl_0/bess_islandmodefrqvld_w]
connect_bd_net [get_bd_pins bess_msi_0/bess_islandmodevld_w_psplbram] [get_bd_pins pspl_bramctrl_0/bess_islandmodevld_w]
connect_bd_net [get_bd_pins bess_msi_0/bess_islandmodevolt_r_crlgc] [get_bd_pins island_resync_0/bess_islandmodevolt_r_crlgc]
connect_bd_net [get_bd_pins bess_msi_0/bess_islandmodevolt_vld_w_psplbram] [get_bd_pins pspl_bramctrl_0/bess_islandmodevoltvld_w]
connect_bd_net [get_bd_pins bess_msi_0/bess_islandmodevolt_w_psplbram] [get_bd_pins pspl_bramctrl_0/bess_islandmodevolt_w]
connect_bd_net [get_bd_pins bess_msi_0/bess_maxchgpwr_r_crlgc] \
  [get_bd_pins load_following_0/bess_maxchgpwr_r] [get_bd_pins island_resync_0/bess_maxchgpwr_r_crlgc] \
  [get_bd_pins load_follow_0/bess_maxchgpwr_r]
connect_bd_net [get_bd_pins bess_msi_0/bess_maxdschgpwr_r_crlgc] \
  [get_bd_pins load_following_0/bess_maxdschgpwr_r] [get_bd_pins island_resync_0/bess_maxdschgpwr_r_crlgc] \
  [get_bd_pins load_follow_0/bess_maxdschgpwr_r]
connect_bd_net [get_bd_pins bess_msi_0/bess_p_w_psplbram] [get_bd_pins pspl_bramctrl_0/bess_p_w]
connect_bd_net [get_bd_pins bess_msi_0/bess_pf_w_psplbram] [get_bd_pins pspl_bramctrl_0/bess_pf_w]
connect_bd_net [get_bd_pins bess_msi_0/bess_pvld_w_psplbram] [get_bd_pins pspl_bramctrl_0/bess_pvld_w]
connect_bd_net [get_bd_pins bess_msi_0/bess_q_w_psplbram] [get_bd_pins pspl_bramctrl_0/bess_q_w]
connect_bd_net [get_bd_pins bess_msi_0/bess_qtyp_w_psplbram] [get_bd_pins pspl_bramctrl_0/bess_qtyp_w]
connect_bd_net [get_bd_pins bess_msi_0/bess_rdata_vld_crlgc] [get_bd_pins load_following_0/bess_rdata_vld] [get_bd_pins load_follow_0/bess_rdata_vld]
connect_bd_net [get_bd_pins bess_msi_0/bess_run_w_psplbram] [get_bd_pins pspl_bramctrl_0/bess_run_w]
connect_bd_net [get_bd_pins bess_msi_0/bess_runvld_w_psplbram] [get_bd_pins pspl_bramctrl_0/bess_runvld_w]
connect_bd_net [get_bd_pins bess_msi_0/bess_soc_r_crlgc] [get_bd_pins load_following_0/bess_soc_r] [get_bd_pins load_follow_0/bess_soc_r]
connect_bd_net [get_bd_pins bess_msi_0/bess_wh_r_crlgc] [get_bd_pins island_resync_0/bess_wh_r_crlgc]
connect_bd_net [get_bd_pins blk_mem_gen_0/douta] [get_bd_pins axi_bram_ctrl_0/bram_rddata_a]
connect_bd_net [get_bd_pins blk_mem_gen_0/doutb] [get_bd_pins pspl_bramctrl_0/bram_din]
connect_bd_net [get_bd_pins blk_mem_gen_1/douta] [get_bd_pins axi_bram_ctrl_1/bram_rddata_a]
connect_bd_net [get_bd_pins blk_mem_gen_1/doutb] [get_bd_pins pspl_bramctrl_0/bramw_din]
connect_bd_net [get_bd_pins genset_msi_0/gen_flt_crlgc] [get_bd_pins island_resync_0/gen_flt_crlgc]
connect_bd_net [get_bd_pins genset_msi_0/gen_gfm_stat_crlgc] [get_bd_pins island_resync_0/gen_gfm_stat_crlgc]
connect_bd_net [get_bd_pins genset_msi_0/gen_opmod_w_psplbram] [get_bd_pins pspl_bramctrl_0/gen_opmod_w]
connect_bd_net [get_bd_pins genset_msi_0/gen_opmodvld_w_psplbram] [get_bd_pins pspl_bramctrl_0/gen_opmodvld_w]
connect_bd_net [get_bd_pins genset_msi_0/gen_p_w_psplbram] [get_bd_pins pspl_bramctrl_0/gen_p_w]
connect_bd_net [get_bd_pins genset_msi_0/gen_pvld_w_psplbram] [get_bd_pins pspl_bramctrl_0/gen_pvld_w]
connect_bd_net [get_bd_pins genset_msi_0/gen_q_w_psplbram] [get_bd_pins pspl_bramctrl_0/gen_q_w]
connect_bd_net [get_bd_pins genset_msi_0/gen_qvld_w_psplbram] [get_bd_pins pspl_bramctrl_0/gen_qvld_w]
connect_bd_net [get_bd_pins genset_msi_0/gen_run_w_psplbram] [get_bd_pins pspl_bramctrl_0/gen_run_w]
connect_bd_net [get_bd_pins genset_msi_0/gen_runvld_w_psplbram] [get_bd_pins pspl_bramctrl_0/gen_runvld_w]
connect_bd_net [get_bd_pins island_resync_0/bess_gfmcmd_crlgc] [get_bd_pins bess_msi_0/bess_gfmcmd_crlgc]
connect_bd_net [get_bd_pins island_resync_0/bess_gfmexit_crlgc] [get_bd_pins bess_msi_0/bess_gfmexit_crlgc]
connect_bd_net [get_bd_pins island_resync_0/bess_islandmodefrq_w_crlgc] [get_bd_pins bess_msi_0/bess_islandmodefrq_w_crlgc]
connect_bd_net [get_bd_pins island_resync_0/bess_islandmodefrqvld_w_crlgc] [get_bd_pins bess_msi_0/bess_islandmodefrqvld_w_crlgc]
connect_bd_net [get_bd_pins island_resync_0/bess_islandmodevolt_w_crlgc] [get_bd_pins bess_msi_0/bess_islandmodevolt_w_crlgc]
connect_bd_net [get_bd_pins island_resync_0/bess_islandmodevoltvld_w_crlgc] [get_bd_pins bess_msi_0/bess_islandmodevoltvld_w_crlgc]
connect_bd_net [get_bd_pins island_resync_0/gen_gfmcmd] [get_bd_pins asset_dispatch_0/gen_gfmcmd]
connect_bd_net [get_bd_pins island_resync_0/gen_gfmshut] [get_bd_pins asset_dispatch_0/gen_gfmshut]
connect_bd_net [get_bd_pins island_resync_0/island_state_sig] [get_bd_pins asset_dispatch_0/island_state_sig]
connect_bd_net [get_bd_pins island_resync_0/pv_p_isl] [get_bd_pins asset_dispatch_0/pv_p_isl]
connect_bd_net [get_bd_pins island_resync_0/pv_pisl_vld] [get_bd_pins asset_dispatch_0/pv_pisl_vld]
connect_bd_net [get_bd_pins island_resync_0/rly_brkclvld_w_crlgc] [get_bd_pins relay_msi_0/rly_brkclvld_w_crlgc]
connect_bd_net [get_bd_pins island_resync_0/rly_brkopvld_w_crlgc] [get_bd_pins relay_msi_0/rly_brkopvld_w_crlgc]
connect_bd_net [get_bd_pins island_resync_0/rly_poibrkcl_crlgc] [get_bd_pins relay_msi_0/rly_poibrkcl_crlgc]
connect_bd_net [get_bd_pins island_resync_0/rly_poibrkop_crlgc] [get_bd_pins relay_msi_0/rly_poibrkop_crlgc]
connect_bd_net [get_bd_pins load_follow_0/bess_p_w] [get_bd_pins asset_dispatch_0/bess_p_pkshv]
connect_bd_net [get_bd_pins load_follow_0/bess_pvld_w] [get_bd_pins asset_dispatch_0/bess_pvld_pkshv]
connect_bd_net [get_bd_pins load_follow_0/pv_p_w] [get_bd_pins asset_dispatch_0/pv_p_expctl]
connect_bd_net [get_bd_pins load_follow_0/pv_pvld_w] [get_bd_pins asset_dispatch_0/pv_pvld_expctl]
connect_bd_net [get_bd_pins load_following_0/bess_p_w] [get_bd_pins asset_dispatch_0/bess_p_ldflw]
connect_bd_net [get_bd_pins load_following_0/bess_pvld_w] [get_bd_pins asset_dispatch_0/bess_pvld_ldflw]
connect_bd_net [get_bd_pins meter_msi_0/meter_bess_3p_crlgc] [get_bd_pins island_resync_0/meter_bess_3p_crlgc]
connect_bd_net [get_bd_pins meter_msi_0/meter_bess_rdatavld_crlgc] [get_bd_pins island_resync_0/meter_bess_rdatavld_crlgc]
connect_bd_net [get_bd_pins meter_msi_0/meter_gen_3p_crlgc] [get_bd_pins island_resync_0/meter_gen_3p_crlgc]
connect_bd_net [get_bd_pins meter_msi_0/meter_gen_rdatavld_crlgc] [get_bd_pins island_resync_0/meter_gen_rdatavld_crlgc]
connect_bd_net [get_bd_pins meter_msi_0/meter_poi_3p_crlgc] \
  [get_bd_pins load_following_0/meter_poi_3p] [get_bd_pins island_resync_0/meter_poi_3p_crlgc] \
  [get_bd_pins load_follow_0/meter_poi_3p]
connect_bd_net [get_bd_pins meter_msi_0/meter_poi_freq_crlgc] [get_bd_pins island_resync_0/meter_poi_freq_crlgc]
connect_bd_net [get_bd_pins meter_msi_0/meter_poi_rdatavld_crlgc] \
  [get_bd_pins load_following_0/meter_rdata_vld] [get_bd_pins island_resync_0/meter_poi_rdatavld_crlgc] \
  [get_bd_pins load_follow_0/meter_rdata_vld]
connect_bd_net [get_bd_pins meter_msi_0/meter_poi_vab_crlgc] [get_bd_pins island_resync_0/meter_poi_vab_crlgc]
connect_bd_net [get_bd_pins meter_msi_0/meter_pv_3p_crlgc] [get_bd_pins island_resync_0/meter_pv_3p_crlgc]
connect_bd_net [get_bd_pins meter_msi_0/meter_pv_rdatavld_crlgc] [get_bd_pins island_resync_0/meter_pv_rdatavld_crlgc]
connect_bd_net [get_bd_pins pspl_bramctrl_0/bess_fault_r] [get_bd_pins bess_msi_0/bess_fault_r_psplbram]
connect_bd_net [get_bd_pins pspl_bramctrl_0/bess_islandmode_r] [get_bd_pins bess_msi_0/bess_islandmode_r_psplbram]
connect_bd_net [get_bd_pins pspl_bramctrl_0/bess_islandmodefrq_r] [get_bd_pins bess_msi_0/bess_islandmodefrq_r_psplbram]
connect_bd_net [get_bd_pins pspl_bramctrl_0/bess_islandmodevolt_r] [get_bd_pins bess_msi_0/bess_islandmodevolt_r_psplbram]
connect_bd_net [get_bd_pins pspl_bramctrl_0/bess_maxchgpwr_r] [get_bd_pins bess_msi_0/bess_maxchgpwr_r_psplbram]
connect_bd_net [get_bd_pins pspl_bramctrl_0/bess_maxdschgpwr_r] [get_bd_pins bess_msi_0/bess_maxdschgpwr_r_psplbram]
connect_bd_net [get_bd_pins pspl_bramctrl_0/bess_rdata_vld] [get_bd_pins bess_msi_0/bess_rdata_vld_psplbram]
connect_bd_net [get_bd_pins pspl_bramctrl_0/bess_soc_r] [get_bd_pins bess_msi_0/bess_soc_r_psplbram]
connect_bd_net [get_bd_pins pspl_bramctrl_0/bess_status_r] [get_bd_pins bess_msi_0/bess_status_r_psplbram]
connect_bd_net [get_bd_pins pspl_bramctrl_0/bess_wh_r] [get_bd_pins bess_msi_0/bess_wh_r_psplbram]
connect_bd_net [get_bd_pins pspl_bramctrl_0/bram_addr] [get_bd_pins blk_mem_gen_0/addrb]
connect_bd_net [get_bd_pins pspl_bramctrl_0/bram_dout] [get_bd_pins blk_mem_gen_0/dinb]
connect_bd_net [get_bd_pins pspl_bramctrl_0/bram_enb] [get_bd_pins blk_mem_gen_0/enb]
connect_bd_net [get_bd_pins pspl_bramctrl_0/bram_web] [get_bd_pins blk_mem_gen_0/web]
connect_bd_net [get_bd_pins pspl_bramctrl_0/bramw_addr] [get_bd_pins blk_mem_gen_1/addrb]
connect_bd_net [get_bd_pins pspl_bramctrl_0/bramw_dout] [get_bd_pins blk_mem_gen_1/dinb]
connect_bd_net [get_bd_pins pspl_bramctrl_0/bramw_enb] [get_bd_pins blk_mem_gen_1/enb]
connect_bd_net [get_bd_pins pspl_bramctrl_0/bramw_web] [get_bd_pins blk_mem_gen_1/web]
connect_bd_net [get_bd_pins pspl_bramctrl_0/gen_fault_r] [get_bd_pins genset_msi_0/gen_fault_r_psplbram]
connect_bd_net [get_bd_pins pspl_bramctrl_0/gen_rdata_vld] [get_bd_pins genset_msi_0/gen_rdata_vld_psplbram]
connect_bd_net [get_bd_pins pspl_bramctrl_0/gen_status_r] [get_bd_pins genset_msi_0/gen_status_r_psplbram]
connect_bd_net [get_bd_pins pspl_bramctrl_0/meter_bess_3p] [get_bd_pins meter_msi_0/meter_bess_3p_psplbram]
connect_bd_net [get_bd_pins pspl_bramctrl_0/meter_gen_3p] [get_bd_pins meter_msi_0/meter_gen_3p_psplbram]
connect_bd_net [get_bd_pins pspl_bramctrl_0/meter_poi_3p] [get_bd_pins meter_msi_0/meter_poi_3p_psplbram]
connect_bd_net [get_bd_pins pspl_bramctrl_0/meter_poi_3q] [get_bd_pins meter_msi_0/meter_poi_3q_psplbram]
connect_bd_net [get_bd_pins pspl_bramctrl_0/meter_poi_3s] [get_bd_pins meter_msi_0/meter_poi_3s_psplbram]
connect_bd_net [get_bd_pins pspl_bramctrl_0/meter_poi_freq] [get_bd_pins meter_msi_0/meter_poi_freq_psplbram]
connect_bd_net [get_bd_pins pspl_bramctrl_0/meter_poi_ia] [get_bd_pins meter_msi_0/meter_poi_ia_psplbram]
connect_bd_net [get_bd_pins pspl_bramctrl_0/meter_poi_ib] [get_bd_pins meter_msi_0/meter_poi_ib_psplbram]
connect_bd_net [get_bd_pins pspl_bramctrl_0/meter_poi_ic] [get_bd_pins meter_msi_0/meter_poi_ic_psplbram]
connect_bd_net [get_bd_pins pspl_bramctrl_0/meter_poi_in] [get_bd_pins meter_msi_0/meter_poi_in_psplbram]
connect_bd_net [get_bd_pins pspl_bramctrl_0/meter_poi_pf] [get_bd_pins meter_msi_0/meter_poi_pf_psplbram]
connect_bd_net [get_bd_pins pspl_bramctrl_0/meter_poi_vab] [get_bd_pins meter_msi_0/meter_poi_vab_psplbram]
connect_bd_net [get_bd_pins pspl_bramctrl_0/meter_poi_vbc] [get_bd_pins meter_msi_0/meter_poi_vbc_psplbram]
connect_bd_net [get_bd_pins pspl_bramctrl_0/meter_poi_vca] [get_bd_pins meter_msi_0/meter_poi_vca_psplbram]
connect_bd_net [get_bd_pins pspl_bramctrl_0/meter_pv_3p] [get_bd_pins meter_msi_0/meter_pv_3p_psplbram]
connect_bd_net [get_bd_pins pspl_bramctrl_0/meter_rdata_vld] [get_bd_pins meter_msi_0/meter_rdata_vld_psplbram]
connect_bd_net [get_bd_pins pspl_bramctrl_0/pv_fault_r] [get_bd_pins pv_msi_0/pv_fault_r_psplbram]
connect_bd_net [get_bd_pins pspl_bramctrl_0/pv_rdata_vld] [get_bd_pins pv_msi_0/pv_rdata_vld_psplbram]
connect_bd_net [get_bd_pins pspl_bramctrl_0/pv_status_r] [get_bd_pins pv_msi_0/pv_status_r_psplbram]
connect_bd_net [get_bd_pins pspl_bramctrl_0/pv_var_r] [get_bd_pins pv_msi_0/pv_var_r_psplbram]
connect_bd_net [get_bd_pins pspl_bramctrl_0/pv_watt_r] [get_bd_pins pv_msi_0/pv_watt_r_psplbram]
connect_bd_net [get_bd_pins pspl_bramctrl_0/pv_wattsp_r] [get_bd_pins pv_msi_0/pv_wattsp_r_psplbram]
connect_bd_net [get_bd_pins pspl_bramctrl_0/pv_yield_r] [get_bd_pins pv_msi_0/pv_yield_r_psplbram]
connect_bd_net [get_bd_pins pspl_bramctrl_0/rly_bfrq_r] [get_bd_pins relay_msi_0/rly_bfrq_r_psplbram]
connect_bd_net [get_bd_pins pspl_bramctrl_0/rly_bvab_r] [get_bd_pins relay_msi_0/rly_bvab_r_psplbram]
connect_bd_net [get_bd_pins pspl_bramctrl_0/rly_bvbc_r] [get_bd_pins relay_msi_0/rly_bvbc_r_psplbram]
connect_bd_net [get_bd_pins pspl_bramctrl_0/rly_bvca_r] [get_bd_pins relay_msi_0/rly_bvca_r_psplbram]
connect_bd_net [get_bd_pins pspl_bramctrl_0/rly_hwerr_r] [get_bd_pins relay_msi_0/rly_hwerr_r_psplbram]
connect_bd_net [get_bd_pins pspl_bramctrl_0/rly_ioltchsv_r] [get_bd_pins relay_msi_0/rly_ioltchsv_r_psplbram]
connect_bd_net [get_bd_pins pspl_bramctrl_0/rly_lfrq_r] [get_bd_pins relay_msi_0/rly_lfrq_r_psplbram]
connect_bd_net [get_bd_pins pspl_bramctrl_0/rly_lvab_r] [get_bd_pins relay_msi_0/rly_lvab_r_psplbram]
connect_bd_net [get_bd_pins pspl_bramctrl_0/rly_lvbc_r] [get_bd_pins relay_msi_0/rly_lvbc_r_psplbram]
connect_bd_net [get_bd_pins pspl_bramctrl_0/rly_lvca_r] [get_bd_pins relay_msi_0/rly_lvca_r_psplbram]
connect_bd_net [get_bd_pins pspl_bramctrl_0/rly_protstat_r] [get_bd_pins relay_msi_0/rly_protstat_r_psplbram]
connect_bd_net [get_bd_pins pspl_bramctrl_0/rly_rdata_vld] [get_bd_pins relay_msi_0/rly_rdata_vld_psplbram]
connect_bd_net [get_bd_pins pspl_bramctrl_0/usr_auto_resync] [get_bd_pins island_resync_0/usr_auto_resync]
connect_bd_net [get_bd_pins pspl_bramctrl_0/usr_autoislnd_en] [get_bd_pins island_resync_0/usr_autoislnd_en]
connect_bd_net [get_bd_pins pspl_bramctrl_0/usr_bess2gen_trnsf] [get_bd_pins island_resync_0/usr_bess2gen_trnsf]
connect_bd_net [get_bd_pins pspl_bramctrl_0/usr_bess_en] \
  [get_bd_pins load_following_0/usr_bess_en] [get_bd_pins island_resync_0/usr_bess_en] \
  [get_bd_pins load_follow_0/usr_bess_en]
connect_bd_net [get_bd_pins pspl_bramctrl_0/usr_bess_gfmprio] [get_bd_pins island_resync_0/usr_bess_gfmprio]
connect_bd_net [get_bd_pins pspl_bramctrl_0/usr_bess_kd] [get_bd_pins load_following_0/usr_bess_kd] [get_bd_pins load_follow_0/usr_bess_kd]
connect_bd_net [get_bd_pins pspl_bramctrl_0/usr_bess_ki] [get_bd_pins load_following_0/usr_bess_ki] [get_bd_pins load_follow_0/usr_bess_ki]
connect_bd_net [get_bd_pins pspl_bramctrl_0/usr_bess_kp] [get_bd_pins load_following_0/usr_bess_kp] [get_bd_pins load_follow_0/usr_bess_kp]
connect_bd_net [get_bd_pins pspl_bramctrl_0/usr_bess_maxsoc] \
  [get_bd_pins load_following_0/usr_bess_maxsoc] [get_bd_pins load_follow_0/usr_bess_maxsoc]
connect_bd_net [get_bd_pins pspl_bramctrl_0/usr_bess_minsoc] \
  [get_bd_pins load_following_0/usr_bess_minsoc] [get_bd_pins load_follow_0/usr_bess_minsoc]
connect_bd_net [get_bd_pins pspl_bramctrl_0/usr_besschrg_lmt] \
  [get_bd_pins load_following_0/usr_besschrg_lmt] [get_bd_pins load_follow_0/usr_besschrg_lmt]
connect_bd_net [get_bd_pins pspl_bramctrl_0/usr_bessdsch_lmt] \
  [get_bd_pins load_following_0/usr_bessdsch_lmt] [get_bd_pins load_follow_0/usr_bessdsch_lmt]
connect_bd_net [get_bd_pins pspl_bramctrl_0/usr_bessislnd_maxwh_ll] [get_bd_pins island_resync_0/usr_bessislnd_maxwh_ll]
connect_bd_net [get_bd_pins pspl_bramctrl_0/usr_bessislnd_maxwh_ul] [get_bd_pins island_resync_0/usr_bessislnd_maxwh_ul]
connect_bd_net [get_bd_pins pspl_bramctrl_0/usr_bessislnd_minwh] [get_bd_pins island_resync_0/usr_bessislnd_minwh]
connect_bd_net [get_bd_pins pspl_bramctrl_0/usr_bessislndext_minwh] [get_bd_pins island_resync_0/usr_bessislndext_minwh]
connect_bd_net [get_bd_pins pspl_bramctrl_0/usr_cltrns_resync] [get_bd_pins island_resync_0/usr_cltrns_resync]
connect_bd_net [get_bd_pins pspl_bramctrl_0/usr_ctrl_mode] \
  [get_bd_pins asset_dispatch_0/usr_ctrl_mode] [get_bd_pins load_following_0/usr_ctrl_mode] \
  [get_bd_pins load_follow_0/usr_ctrl_mode]
connect_bd_net [get_bd_pins pspl_bramctrl_0/usr_exp_lmt] [get_bd_pins load_follow_0/usr_exp_lmt]
connect_bd_net [get_bd_pins pspl_bramctrl_0/usr_exp_prio] [get_bd_pins load_follow_0/usr_exp_prio]
connect_bd_net [get_bd_pins pspl_bramctrl_0/usr_gen2bess_trnsf] [get_bd_pins island_resync_0/usr_gen2bess_trnsf]
connect_bd_net [get_bd_pins pspl_bramctrl_0/usr_gen_baseld] [get_bd_pins island_resync_0/usr_gen_baseld]
connect_bd_net [get_bd_pins pspl_bramctrl_0/usr_gen_en] [get_bd_pins island_resync_0/usr_gen_en]
connect_bd_net [get_bd_pins pspl_bramctrl_0/usr_gen_gfmprio] [get_bd_pins island_resync_0/usr_gen_gfmprio]
connect_bd_net [get_bd_pins pspl_bramctrl_0/usr_grdhlthy_dur] [get_bd_pins island_resync_0/usr_grdhlthy_dur]
connect_bd_net [get_bd_pins pspl_bramctrl_0/usr_grdhlthy_fmax] [get_bd_pins island_resync_0/usr_grdhlthy_fmax]
connect_bd_net [get_bd_pins pspl_bramctrl_0/usr_grdhlthy_fmin] [get_bd_pins island_resync_0/usr_grdhlthy_fmin]
connect_bd_net [get_bd_pins pspl_bramctrl_0/usr_grdhlthy_vmax] [get_bd_pins island_resync_0/usr_grdhlthy_vmax]
connect_bd_net [get_bd_pins pspl_bramctrl_0/usr_grdhlthy_vmin] [get_bd_pins island_resync_0/usr_grdhlthy_vmin]
connect_bd_net [get_bd_pins pspl_bramctrl_0/usr_grid_resync] [get_bd_pins island_resync_0/usr_grid_resync]
connect_bd_net [get_bd_pins pspl_bramctrl_0/usr_imp_lmt] [get_bd_pins load_follow_0/usr_imp_lmt]
connect_bd_net [get_bd_pins pspl_bramctrl_0/usr_islnd_cmd] [get_bd_pins island_resync_0/usr_islnd_cmd]
connect_bd_net [get_bd_pins pspl_bramctrl_0/usr_maxld_islnd] [get_bd_pins island_resync_0/usr_maxld_islnd]
connect_bd_net [get_bd_pins pspl_bramctrl_0/usr_net_load] [get_bd_pins load_following_0/usr_net_load]
connect_bd_net [get_bd_pins pspl_bramctrl_0/usr_param_vld] \
  [get_bd_pins asset_dispatch_0/usr_param_vld] [get_bd_pins load_following_0/usr_param_vld] \
  [get_bd_pins island_resync_0/usr_param_vld] [get_bd_pins load_follow_0/usr_param_vld]
connect_bd_net [get_bd_pins pspl_bramctrl_0/usr_poibrkcl_cmd] [get_bd_pins island_resync_0/usr_poibrkcl_cmd]
connect_bd_net [get_bd_pins pspl_bramctrl_0/usr_pv_en] \
  [get_bd_pins load_following_0/usr_pv_en] [get_bd_pins island_resync_0/usr_pv_en] [get_bd_pins load_follow_0/usr_pv_en]
connect_bd_net [get_bd_pins pspl_bramctrl_0/usr_pv_kd] [get_bd_pins island_resync_0/usr_pv_kd] [get_bd_pins load_follow_0/usr_pv_kd]
connect_bd_net [get_bd_pins pspl_bramctrl_0/usr_pv_ki] [get_bd_pins island_resync_0/usr_pv_ki] [get_bd_pins load_follow_0/usr_pv_ki]
connect_bd_net [get_bd_pins pspl_bramctrl_0/usr_pv_kp] [get_bd_pins island_resync_0/usr_pv_kp] [get_bd_pins load_follow_0/usr_pv_kp]
connect_bd_net [get_bd_pins pspl_bramctrl_0/usr_pv_max] [get_bd_pins island_resync_0/usr_pv_max] [get_bd_pins load_follow_0/usr_pv_max]
connect_bd_net [get_bd_pins pspl_bramctrl_0/usr_shut_down] [get_bd_pins asset_dispatch_0/usr_shut_down]
connect_bd_net [get_bd_pins pspl_bramctrl_0/wcmd_sig] [get_bd_pins xlslice_10/Din] [get_bd_pins xlslice_11/Din]
connect_bd_net [get_bd_pins pv_msi_0/pv_fault_r_corelogic] [get_bd_pins load_follow_0/pv_fault_r]
connect_bd_net [get_bd_pins pv_msi_0/pv_p_w_psplbram] [get_bd_pins pspl_bramctrl_0/pv_p_w]
connect_bd_net [get_bd_pins pv_msi_0/pv_pf_w_psplbram] [get_bd_pins pspl_bramctrl_0/pv_pf_w]
connect_bd_net [get_bd_pins pv_msi_0/pv_pvld_w_psplbram] [get_bd_pins pspl_bramctrl_0/pv_pvld_w]
connect_bd_net [get_bd_pins pv_msi_0/pv_q_w_psplbram] [get_bd_pins pspl_bramctrl_0/pv_q_w]
connect_bd_net [get_bd_pins pv_msi_0/pv_qtyp_w_psplbram] [get_bd_pins pspl_bramctrl_0/pv_qtyp_w]
connect_bd_net [get_bd_pins pv_msi_0/pv_rdata_vld_corelogic] [get_bd_pins load_follow_0/pv_rdata_vld]
connect_bd_net [get_bd_pins pv_msi_0/pv_run_w_psplbram] [get_bd_pins pspl_bramctrl_0/pv_run_w]
connect_bd_net [get_bd_pins pv_msi_0/pv_runvld_w_psplbram] [get_bd_pins pspl_bramctrl_0/pv_runvld_w]
connect_bd_net [get_bd_pins pv_msi_0/pv_status_r_corelogic] [get_bd_pins load_follow_0/pv_status_r]
connect_bd_net [get_bd_pins pv_msi_0/pv_watt_r_corelogic] [get_bd_pins load_follow_0/pv_watt_r]
connect_bd_net [get_bd_pins pv_msi_0/pv_wattsp_r_corelogic] [get_bd_pins load_follow_0/pv_wattsp_r]
connect_bd_net [get_bd_pins relay_msi_0/poi_cb_cl] [get_bd_pins island_resync_0/poi_cb_cl_crlgc]
connect_bd_net [get_bd_pins relay_msi_0/poi_cb_op] [get_bd_pins island_resync_0/poi_cb_op_crlgc]
connect_bd_net [get_bd_pins relay_msi_0/rly_brkcl_w_psplbram] [get_bd_pins pspl_bramctrl_0/rly_brkcl_w]
connect_bd_net [get_bd_pins relay_msi_0/rly_brkclvld_w_psplbram] [get_bd_pins pspl_bramctrl_0/rly_brkclvld_w]
connect_bd_net [get_bd_pins relay_msi_0/rly_brkop_w_psplbram] [get_bd_pins pspl_bramctrl_0/rly_brkop_w]
connect_bd_net [get_bd_pins relay_msi_0/rly_brkopvld_w_psplbram] [get_bd_pins pspl_bramctrl_0/rly_brkopvld_w]
connect_bd_net [get_bd_pins relay_msi_0/rly_oc_prot] [get_bd_pins island_resync_0/rly_oc_prot_crlgc]
connect_bd_net [get_bd_pins rst_ps8_0_100M/peripheral_aresetn] \
  [get_bd_pins asset_dispatch_0/arst_n] [get_bd_pins bess_msi_0/arst_n] [get_bd_pins relay_msi_0/arst_n] \
  [get_bd_pins genset_msi_0/arst_n] [get_bd_pins axi_bram_ctrl_0/s_axi_aresetn] [get_bd_pins axi_bram_ctrl_1/s_axi_aresetn] \
  [get_bd_pins axi_cdma_0/s_axi_lite_aresetn] [get_bd_pins ps8_0_axi_periph/ARESETN] \
  [get_bd_pins ps8_0_axi_periph/S00_ARESETN] [get_bd_pins ps8_0_axi_periph/M00_ARESETN] \
  [get_bd_pins ps8_0_axi_periph/M01_ARESETN] [get_bd_pins axi_gpio_0/s_axi_aresetn] [get_bd_pins axi_smc/aresetn] \
  [get_bd_pins load_following_0/arst_n] [get_bd_pins island_resync_0/arst_n] [get_bd_pins pv_msi_0/arst_n] \
  [get_bd_pins pspl_bramctrl_0/arst_n] [get_bd_pins load_follow_0/arst_n]
connect_bd_net [get_bd_pins xlconcat_0/dout] [get_bd_pins zynq_ultra_ps_e_0/pl_ps_irq0]
connect_bd_net -net xlconstant_0_dout [get_bd_pins xlconstant_axcache/dout] \
  [get_bd_pins axi_smc/S00_AXI_awcache] [get_bd_pins axi_smc/S00_AXI_arcache]
connect_bd_net [get_bd_pins xlconstant_axprot/dout] [get_bd_pins axi_smc/S00_AXI_awprot] [get_bd_pins axi_smc/S00_AXI_arprot]
connect_bd_net [get_bd_pins xlslice_10/Dout] [get_bd_pins axi_gpio_0/gpio_io_i]
connect_bd_net [get_bd_pins xlslice_11/Dout] [get_bd_pins axi_gpio_0/gpio2_io_i]
connect_bd_net [get_bd_pins xlslice_12/Dout] [get_bd_pins pspl_bramctrl_0/pvmeter_bram_rdataflg]
connect_bd_net [get_bd_pins xlslice_13/Dout] [get_bd_pins pspl_bramctrl_0/genmeter_bram_rdataflg]
connect_bd_net [get_bd_pins xlslice_14/Dout] [get_bd_pins pspl_bramctrl_0/loadmeter_bram_rdataflg]
connect_bd_net [get_bd_pins xlslice_1/Dout] [get_bd_pins pspl_bramctrl_0/pv_bram_rdataflg]
connect_bd_net [get_bd_pins xlslice_2/Dout] [get_bd_pins pspl_bramctrl_0/meter_bram_rdataflg]
connect_bd_net [get_bd_pins xlslice_3/Dout] [get_bd_pins pspl_bramctrl_0/gen_bram_rdataflg]
connect_bd_net [get_bd_pins xlslice_4/Dout] [get_bd_pins pspl_bramctrl_0/rly_bram_rdataflg]
connect_bd_net [get_bd_pins xlslice_5/Dout] [get_bd_pins pspl_bramctrl_0/bessmeter_bram_rdataflg]
connect_bd_net [get_bd_pins xlslice_6/Dout] [get_bd_pins pspl_bramctrl_0/usrparam_bram_rdataflg]
connect_bd_net [get_bd_pins xlslice_7/Dout] [get_bd_pins pspl_bramctrl_0/pspl_wcmd_bsy]
connect_bd_net [get_bd_pins xlslice_8/Dout] [get_bd_pins blk_mem_gen_0/addra]
connect_bd_net [get_bd_pins xlslice_9/Dout] [get_bd_pins blk_mem_gen_1/addra]
connect_bd_net [get_bd_pins zynq_ultra_ps_e_0/emio_gpio_o] \
  [get_bd_pins xlslice_0/Din] [get_bd_pins xlslice_1/Din] [get_bd_pins xlslice_2/Din] [get_bd_pins xlslice_3/Din] \
  [get_bd_pins xlslice_4/Din] [get_bd_pins xlslice_5/Din] [get_bd_pins xlslice_6/Din] [get_bd_pins xlslice_7/Din] \
  [get_bd_pins xlslice_12/Din] [get_bd_pins xlslice_13/Din] [get_bd_pins xlslice_14/Din]
connect_bd_net [get_bd_pins zynq_ultra_ps_e_0/pl_clk0] \
  [get_bd_pins asset_dispatch_0/clkin] [get_bd_pins bess_msi_0/clkin] [get_bd_pins relay_msi_0/clkin] \
  [get_bd_pins genset_msi_0/clkin] [get_bd_pins axi_bram_ctrl_0/s_axi_aclk] [get_bd_pins axi_bram_ctrl_1/s_axi_aclk] \
  [get_bd_pins axi_cdma_0/m_axi_aclk] [get_bd_pins axi_cdma_0/s_axi_lite_aclk] [get_bd_pins blk_mem_gen_1/clkb] \
  [get_bd_pins blk_mem_gen_0/clkb] [get_bd_pins ps8_0_axi_periph/ACLK] [get_bd_pins ps8_0_axi_periph/S00_ACLK] \
  [get_bd_pins ps8_0_axi_periph/M00_ACLK] [get_bd_pins ps8_0_axi_periph/M01_ACLK] [get_bd_pins axi_gpio_0/s_axi_aclk] \
  [get_bd_pins axi_smc/aclk] [get_bd_pins rst_ps8_0_100M/slowest_sync_clk] [get_bd_pins zynq_ultra_ps_e_0/maxihpm0_fpd_aclk] \
  [get_bd_pins zynq_ultra_ps_e_0/saxihpc0_fpd_aclk] [get_bd_pins load_following_0/clkin] [get_bd_pins island_resync_0/clkin] \
  [get_bd_pins pv_msi_0/clkin] [get_bd_pins pspl_bramctrl_0/clkin] [get_bd_pins load_follow_0/clkin]
connect_bd_net [get_bd_pins zynq_ultra_ps_e_0/pl_resetn0] [get_bd_pins rst_ps8_0_100M/ext_reset_in]

# ---- address map ----
assign_bd_address -offset 0x0000000000000000 -range 2G -target_address_space [get_bd_addr_spaces axi_cdma_0/Data] [get_bd_addr_segs zynq_ultra_ps_e_0/SAXIGP0/HPC0_DDR_LOW]
assign_bd_address -offset 0x00000000C0000000 -range 4K -target_address_space [get_bd_addr_spaces axi_cdma_0/Data] [get_bd_addr_segs axi_bram_ctrl_0/S_AXI/Mem0]
assign_bd_address -offset 0x00000000C0001000 -range 4K -target_address_space [get_bd_addr_spaces axi_cdma_0/Data] [get_bd_addr_segs axi_bram_ctrl_1/S_AXI/Mem0]
assign_bd_address -offset 0x0000000800000000 -range 2G -target_address_space [get_bd_addr_spaces axi_cdma_0/Data] [get_bd_addr_segs zynq_ultra_ps_e_0/SAXIGP0/HPC0_DDR_HIGH]
exclude_bd_addr_seg -offset 0x00000000FF000000 -range 16M -target_address_space [get_bd_addr_spaces axi_cdma_0/Data] [get_bd_addr_segs zynq_ultra_ps_e_0/SAXIGP0/HPC0_LPS_OCM]
assign_bd_address -offset 0x00A0000000 -range 64K -target_address_space [get_bd_addr_spaces zynq_ultra_ps_e_0/Data] [get_bd_addr_segs axi_cdma_0/S_AXI_LITE/Reg]
assign_bd_address -offset 0x00A0010000 -range 64K -target_address_space [get_bd_addr_spaces zynq_ultra_ps_e_0/Data] [get_bd_addr_segs axi_gpio_0/S_AXI/Reg]

validate_bd_design
save_bd_design
